# EAGLE board EEZ DIB DCP405 r3B3a (EAGLE 7.2.0), part 1 of 2
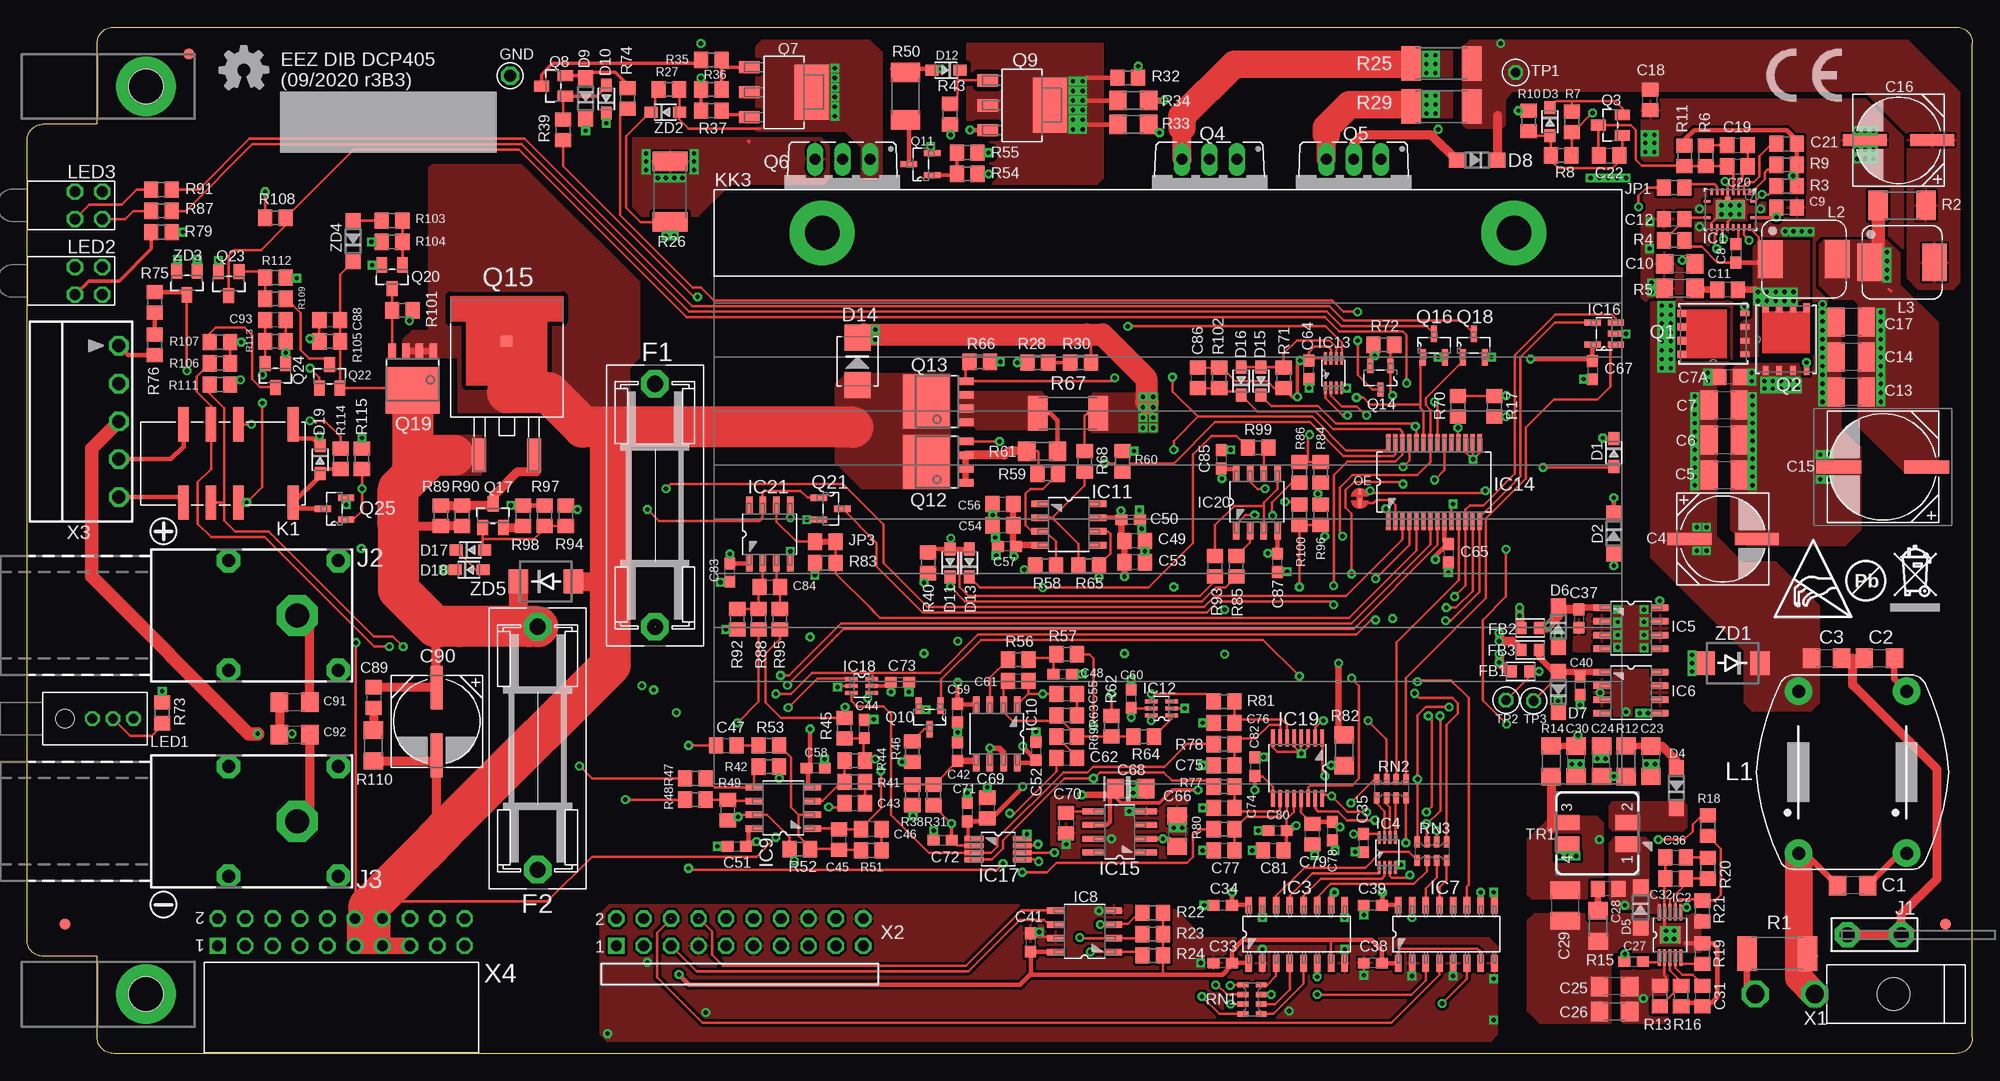
[diagram p6: board, top side]
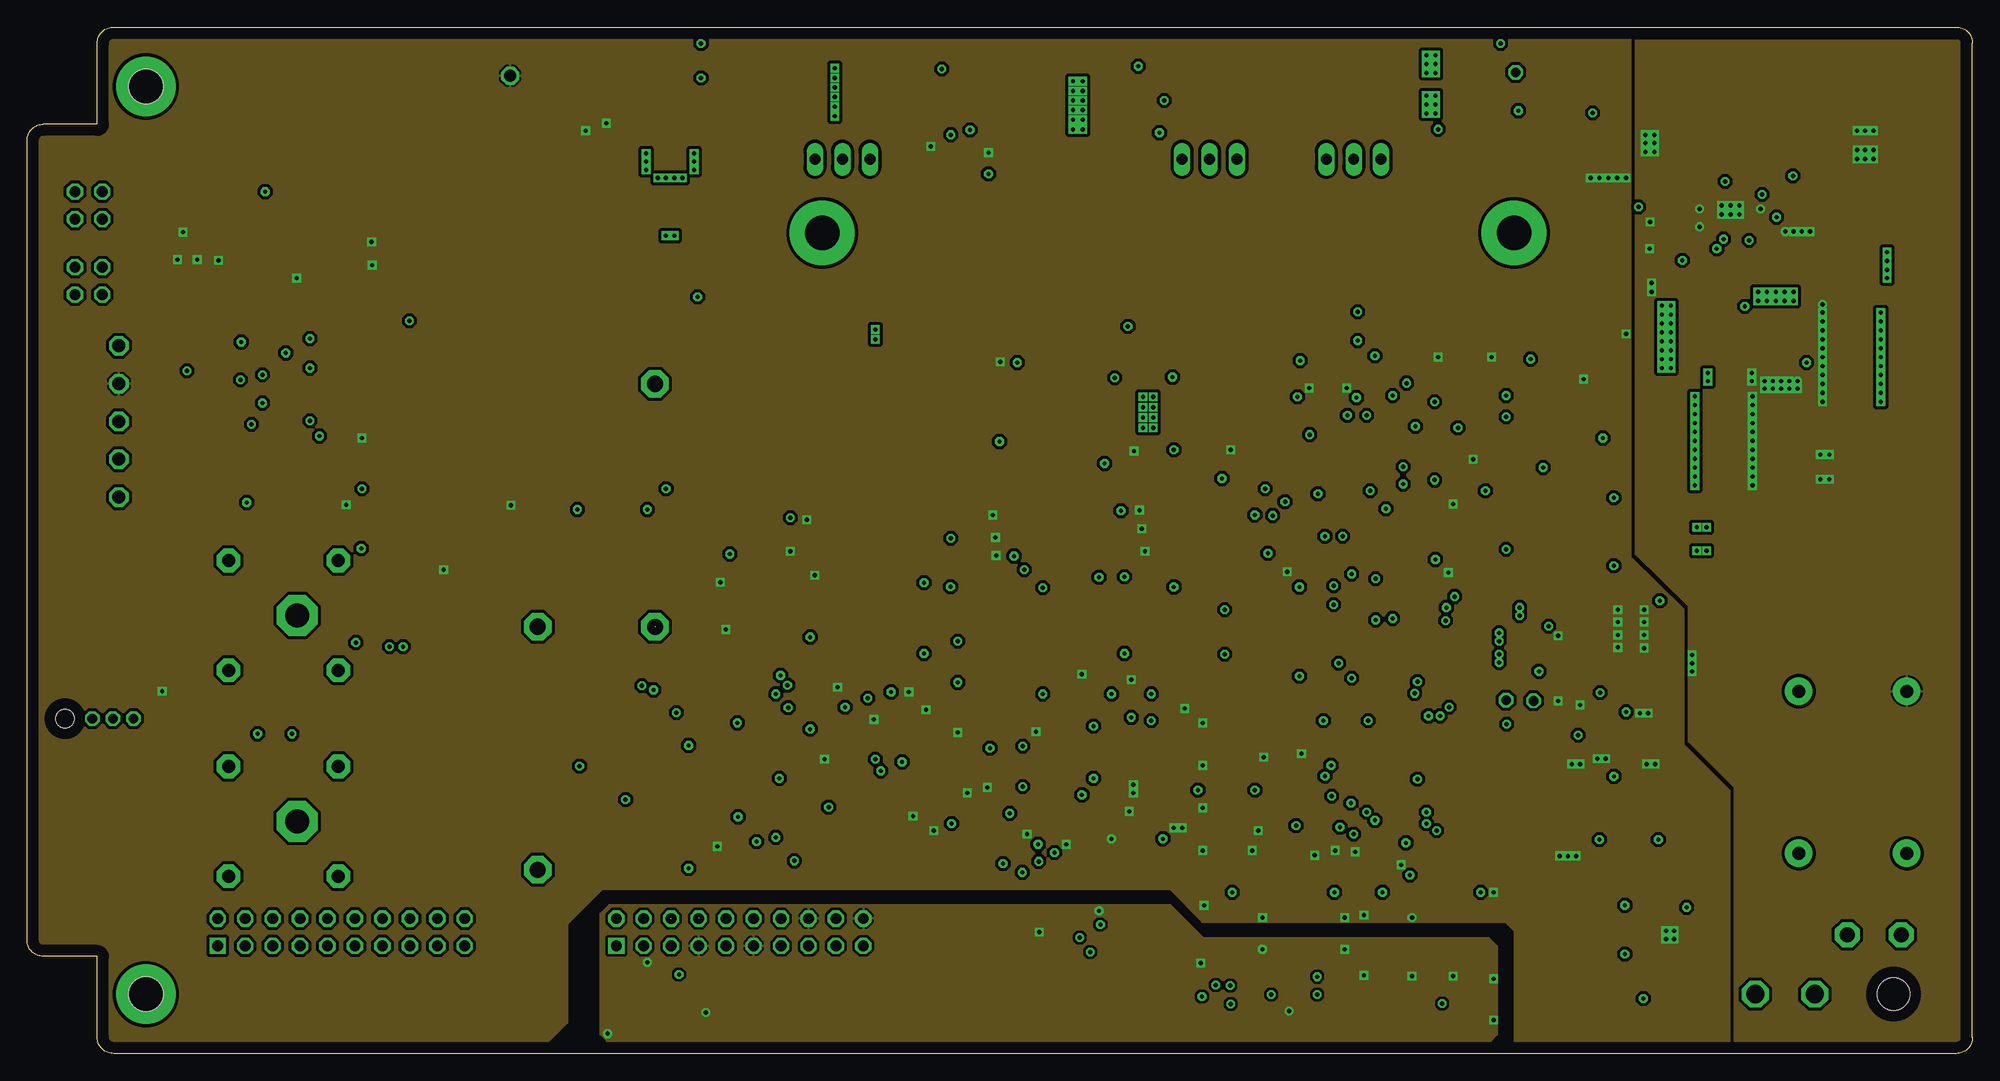
[diagram p7: board, inner layer L2]
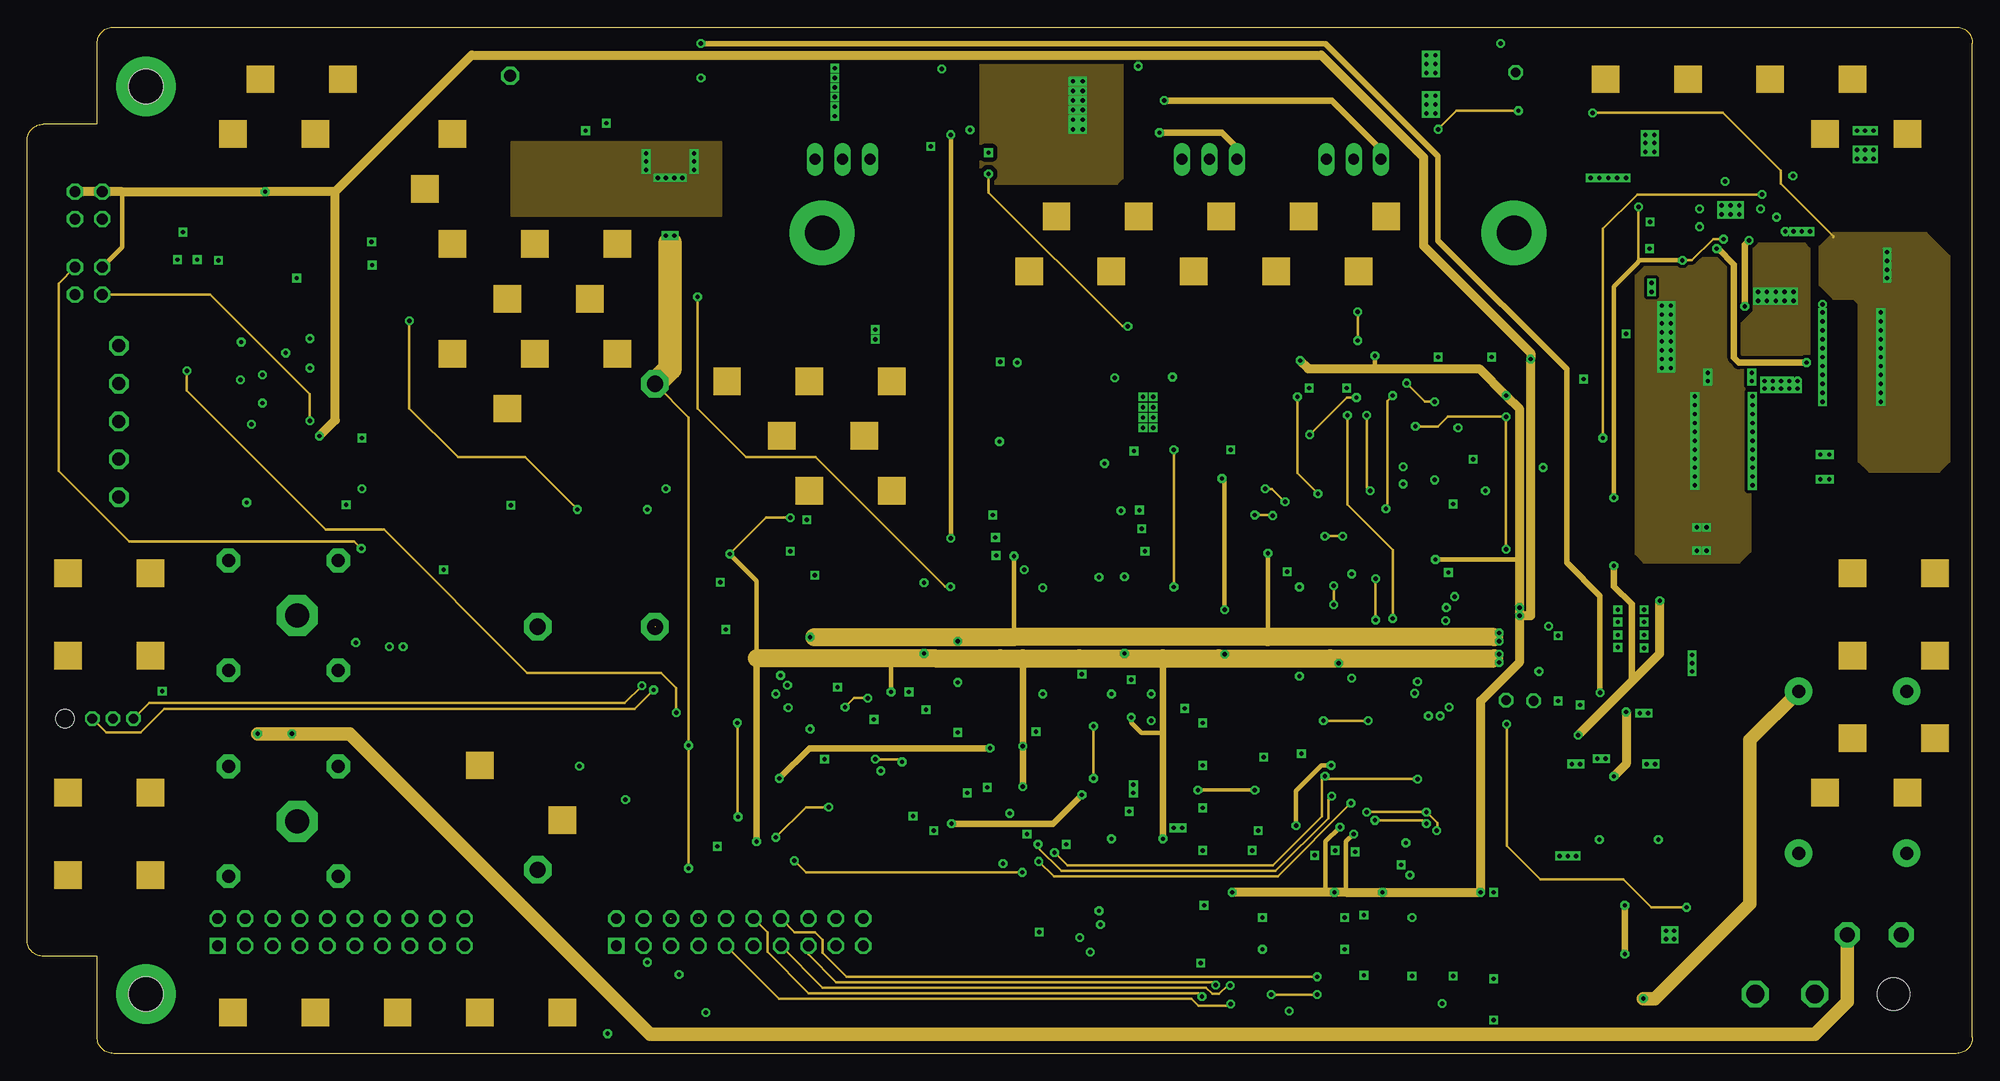
[diagram p8: board, inner layer L3]
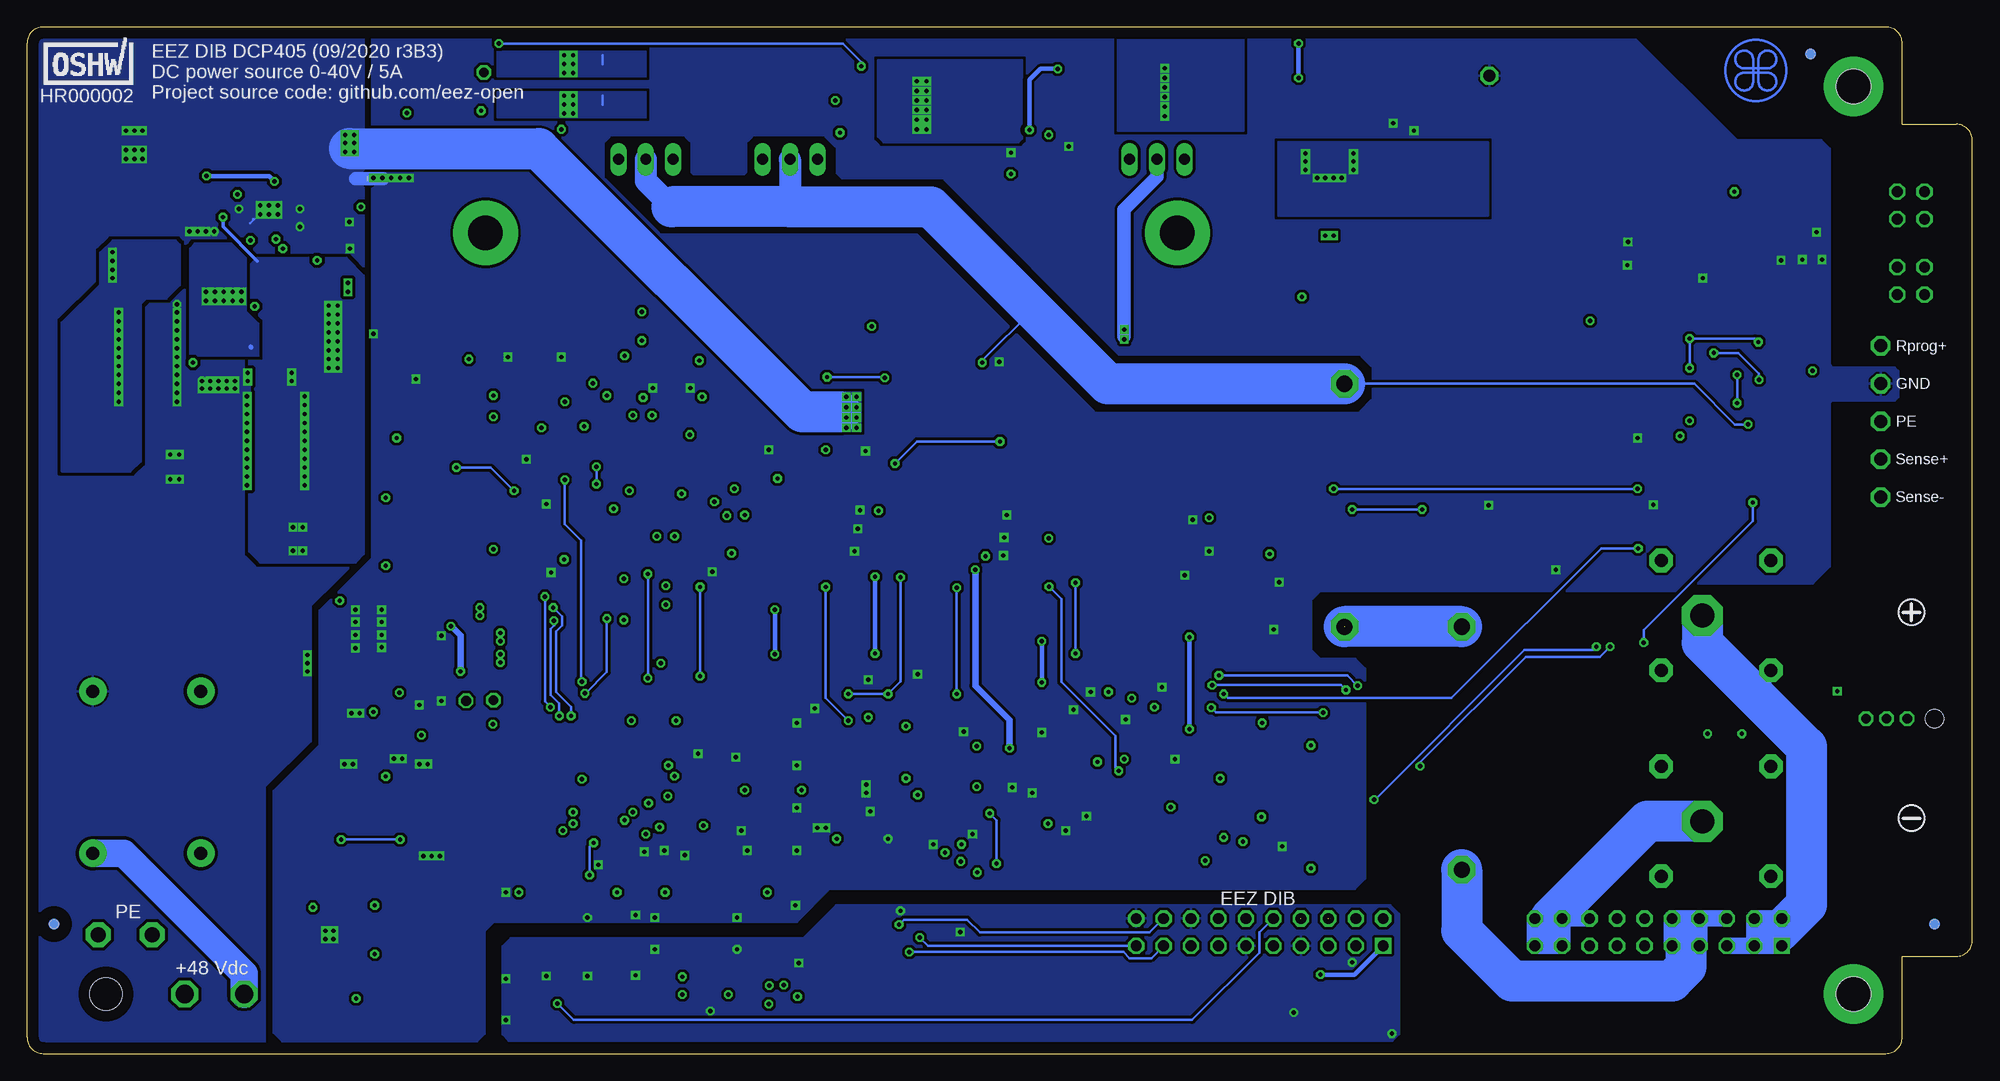
[diagram p9: board, bottom side, seen from below]

Size 180 x 95 mm. Coordinates in mm from the lower left corner, seen from the top.
Outline: 8,95 178.5,95 arc-90 180,93.5 180,1.5 arc-90 178.5,0 8,0 arc-90 6.5,1.5 6.5,9 1.5,9 arc-90 0,10.5 0,84.5 arc-90 1.5,86 6.5,86 6.5,93.5 arc-90 8,95
Copper layers (1+2+15+16): Top 0.035mm / dielectric 7mil / L2 0.03mm / dielectric 44mil / L3 0.03mm / dielectric 7mil / Bottom 0.035mm
Design rules "default *": minimum track width 6mil, minimum drill 0.3mm, track to track 6mil, track to pad 6mil, pad to pad 6mil, via to via 6mil, smd to smd 6mil, copper to edge 40mil, drill to drill 8mil, minimum pad ring 4mil, minimum via ring 8mil, stop-mask expansion 2.5mil, vias tented up to drill 1mm, thermal gap 8mil
Net classes: 0 default: width 0.203 mm, drill 0.3 mm, clearance 0.203 mm; 1 lvds: width 0.152 mm, drill 0.3 mm, clearance 0.152 mm to class 0, clearance 0.152 mm; 2 gnd: width 0.254 mm, drill 0.584 mm, clearance 0.254 mm
vRestrict: area 53,0 to 128,8.5; area 0,0 to 42,14

## Footprints (pad centres in the part's own frame; a part is rotated, then mirrored left to right if it is on the bottom)
C1206 = smd 1.6 x 1.8: 1 -1.4,0; 2 1.4,0
CAPAE830X1050N = smd 4.064 x 1.092: + -3.124,0; - 3.124,0
C1210 = smd 1.6 x 2.7: 1 -1.4,0; 2 1.4,0
C0805 = smd 1.3 x 1.5: 1 -0.95,0; 2 0.95,0
C0603 = smd 1.1 x 1: 1 -0.85,0; 2 0.85,0
CAPAE1030X1050N = smd 4.166 x 1.194: + -4.064,0; - 4.064,0
EC1206 = smd 1.6 x 1.8: + -1.4,0; - 1.4,0
SOD323-R = smd 1.2 x 1: A 1.3,0; C -1.3,0
SOD123 = smd 1.4 x 1.4: A 1.9,0; C -1.9,0
SMB = smd 2.4 x 2.4: A 2.2,0; C -2.2,0
ZH32 = drill 1.5 pad 2.54 octagon: 1 -11.25,0; 2 11.25,0
BEAD0603 = smd 1 x 1.1: P$1 -0.85,0; P$2 0.85,0
FIDUCIAL_DUAL = smd 1.016 x 1.016 bottom: B 0,0 | smd 1.016 x 1.016: T 0,0
PCB_SHIELD_TAB = drill 1.1 octagon: 1 0,0
RGY0020B = smd 0.24 x 0.6: 1 -0.75,2.15; 10 -0.75,-2.15; 11 0.75,-2.15; 20 0.75,2.15 | smd 0.6 x 0.24: 2 -1.65,1.75; 3 -1.65,1.25; 4 -1.65,0.75; 5 -1.65,0.25; 6 -1.65,-0.25; 7 -1.65,-0.75; 8 -1.65,-1.25; 9 -1.65,-1.75; 12 1.65,-1.75; 13 1.65,-1.25; 14 1.65,-0.75; 15 1.65,-0.25; 16 1.65,0.25; 17 1.65,0.75; 18 1.65,1.25; 19 1.65,1.75 | smd 1.7 x 2.7: 21 0,0
SOP50P490X110-11N = smd 1.549 x 0.279: 1 -2.108,0.991; 2 -2.108,0.508; 3 -2.108,0; 4 -2.108,-0.508; 5 -2.108,-0.991; 6 2.108,-0.991; 7 2.108,-0.508; 8 2.108,0; 9 2.108,0.508; 10 2.108,0.991 | smd 1.575 x 1.88: TP 0,0
SOIC-16 = smd 1.549 x 0.61: 1 -2.692,4.445; 2 -2.692,3.175; 3 -2.692,1.905; 4 -2.692,0.635; 5 -2.692,-0.635; 6 -2.692,-1.905; 7 -2.692,-3.175; 8 -2.692,-4.445; 9 2.692,-4.445; 10 2.692,-3.175; 11 2.692,-1.905; 12 2.692,-0.635; 13 2.692,0.635; 14 2.692,1.905; 15 2.692,3.175; 16 2.692,4.445
DCU8 = smd 1.168 x 0.254: 1 -1.372,0.75; 2 -1.372,0.25; 3 -1.372,-0.25; 4 -1.372,-0.75; 5 1.372,-0.75; 6 1.372,-0.25; 7 1.372,0.25; 8 1.372,0.75
SOIC127P600X173-8N = smd 1.55 x 0.6: 1 -2.7,1.9; 2 -2.7,0.63; 3 -2.7,-0.64; 4 -2.7,-1.91; 5 2.7,-1.91; 6 2.7,-0.64; 7 2.7,0.63; 8 2.7,1.9
SOT65P210X110-6N = smd 1.168 x 0.356: 1 -0.94,0.66; 2 -0.94,0; 3 -0.94,-0.66; 4 0.94,-0.66; 5 0.94,0; 6 0.94,0.66
SOP65P780X200-28N = smd 1.651 x 0.432: 1 -3.632,4.216; 2 -3.632,3.581; 3 -3.632,2.921; 4 -3.632,2.286; 5 -3.632,1.626; 6 -3.632,0.965; 7 -3.632,0.33; 8 -3.632,-0.33; 9 -3.632,-0.965; 10 -3.632,-1.626; 11 -3.632,-2.286; 12 -3.632,-2.921; 13 -3.632,-3.581; 14 -3.632,-4.216; 15 3.632,-4.216; 16 3.632,-3.581; 17 3.632,-2.921; 18 3.632,-2.286; 19 3.632,-1.626; 20 3.632,-0.965; 21 3.632,-0.33; 22 3.632,0.33; 23 3.632,0.965; 24 3.632,1.626; 25 3.632,2.286; 26 3.632,2.921; 27 3.632,3.581; 28 3.632,4.216
SOIC127P600X175-8N = smd 1.981 x 0.559: 1 -2.464,1.905; 2 -2.464,0.635; 3 -2.464,-0.635; 4 -2.464,-1.905; 5 2.464,-1.905; 6 2.464,-0.635; 7 2.464,0.635; 8 2.464,1.905
SOT23-5 = smd 1.524 x 0.559: 1 -1.079,1.016; 2 -1.079,0; 3 -1.079,-1.016; 4 1.079,-1.016; 5 1.079,1.016
DGK8-M = smd 1.727 x 0.483: 1 -2.235,0.965; 2 -2.235,0.33; 3 -2.235,-0.33; 4 -2.235,-0.965; 5 2.235,-0.965; 6 2.235,-0.33; 7 2.235,0.33; 8 2.235,0.965
PW(R-PDSO-G16) = smd 1.6 x 0.35: 1 -2.8,2.3; 2 -2.8,1.65; 3 -2.8,1; 4 -2.8,0.35; 5 -2.8,-0.3; 6 -2.8,-0.95; 7 -2.8,-1.6; 8 -2.8,-2.25; 9 2.8,-2.25; 10 2.8,-1.6; 11 2.8,-0.95; 12 2.8,-0.3; 13 2.8,0.35; 14 2.8,1; 15 2.8,1.65; 16 2.8,2.3
PCB_TAB-4907 = drill 1.4 pad 2.3 octagon: 1 -2.5,0; 2 2.5,0
S16N-PC = drill 2.2 pad 3.81 octagon: 1 0,0 | drill 1.2 pad 2.184 octagon: NC1 -3.8,5.08; NC2 -3.8,-5.08; NC3 6.36,5.08; NC4 6.36,-5.08
R_0805 = smd 1.3 x 1.5: 1 -0.95,0; 2 0.95,0
JP2-0805-NOCUT = smd 1.3 x 1.5: 1 -0.95,0; 2 0.95,0
FTR-C1 = smd 1 x 3.16: 1 -6.35,-3.62; 3 -1.27,-3.62; 4 1.27,-3.62; 5 3.81,-3.62; 8 3.81,3.62; 9 1.27,3.62; 10 -1.27,3.62; 12 -6.35,3.62
PCB-MB = hole 3.2: 0,0
SK96/84 = drill 3.2 pad 6: 1 10,4; 2 74,4
RN112 = drill 1.2 pad 2.54: 1 -7.5,5; 2 7.5,5; 3 -7.5,-5; 4 7.5,-5
PANASONIC_ETQ-P4_KFM = smd 2.3 x 3.5: 1 -3.1,0; 2 3.1,0
COILCRAFT_HPI0630 = smd 2.3 x 3.5: 1 -3,0; 2 3,0
L-42WUM-1EGWT = drill 0.9 octagon: CC 4.445,0; GREEN 6.35,0; RED 2.54,0 | hole 1.7: 0,0
WP934MD = drill 1 octagon: BA -1.27,1.27; BC -1.27,-1.27; TA 1.27,1.27; TC 1.27,-1.27
JP2-NOCUT = smd 0.889 x 0.254: 1 -0.445,0 | smd 0.508 x 0.254: 2 0.635,0
TDSON-8 = smd 0.838 x 0.508: 1 -2.913,1.905; 2 -2.913,0.635; 3 -2.913,-0.635; 4 -2.913,-1.905 | smd 0.813 x 0.61: 5 2.913,-1.905; 6 2.913,-0.635; 7 2.913,0.635; 8 2.913,1.905
SOT23-BEC = smd 1 x 1.4: B -0.95,-1.1; C 0,1.1; E 0.95,-1.1
TO220FP-V = drill 1.016 long: 1 -2.54,-0.203; 2 0,-0.203; 3 2.54,-0.203
SOT230P700X180-4N = smd 1.905 x 1.143: 1 -3.2,2.311; 2 -3.2,0; 3 -3.2,-2.311 | smd 3.175 x 5.08: 4 2.565,0
SOT103P240X110-3N = smd 1.524 x 0.559: 1 -1.079,1.016; 2 -1.079,-1.016; 3 1.079,0
SOT669 = smd 0.7 x 1.4: 1 -1.905,-2.65; 2 -0.635,-2.65; 3 0.635,-2.65; 4 1.905,-2.65 | smd 5 x 4.3: MB 0,1
SOT95P237X112-3N = smd 1.321 x 0.559: 1 -1.092,0.94; 2 -1.092,-0.94; 3 1.092,0
D2PAK = smd 1.3 x 3.1: 1 -2.54,-10.528; 3 2.54,-10.528 | smd 1 x 1: 2 0,0
R2512 = smd 1.8 x 3.2: 1 -2.8,0; 2 2.8,0
R2010 = smd 1.8 x 2.7: 1 -2.2,0; 2 2.2,0
R0805 = smd 1.3 x 1.5: 1 -0.95,0; 2 0.95,0
R1206 = smd 1.6 x 1.803: 1 -1.422,0; 2 1.422,0
R_2512-4WIRE = smd 1.8 x 3.2: 1 -2.8,0; 2 2.8,0 | smd 1.27 x 0.254: 1S -2.413,0; 2S 2.413,0
CAY16 = smd 0.5 x 1: 1 -1.35,-0.85; 2 -0.45,-0.85; 3 0.45,-0.85; 4 1.35,-0.85; 5 1.35,0.85; 6 0.45,0.85; 7 -0.45,0.85; 8 -1.35,0.85
SHORT_NOHOLE = smd 0.5 x 0.25 bottom: 1 0,0.117; 2 0,-0.117
TEST-PIN_0.9MM = drill 0.9 octagon: 1 0,0
SRF0703 = smd 1.4 x 2.3: 1 1,2.8; 2 -1,2.8; 3 -1,-2.8; 4 1,-2.8
MINIFIT_39301020 = drill 1.7 octagon: 1 0,0; 2 0,5.5 | hole 3: 0,-7.3
77317-104-20LF = drill 1 pad 1.5 square: 1 -22.86,-2.54 | drill 1 pad 1.5 octagon: 2 -22.86,0; 3 -20.32,-2.54; 4 -20.32,0; 5 -17.78,-2.54; 6 -17.78,0; 7 -15.24,-2.54; 8 -15.24,0; 9 -12.7,-2.54; 10 -12.7,0; 11 -10.16,-2.54; 12 -10.16,0; 13 -7.62,-2.54; 14 -7.62,0; 15 -5.08,-2.54; 16 -5.08,0; 17 -2.54,-2.54; 18 -2.54,0; 19 0,-2.54; 20 0,0
MC1,5/5-G-3,5 = drill 1.2 octagon: 1 -7,0; 2 -3.5,0; 3 0,0; 4 3.5,0; 5 7,0
SSW-110-02-T-D-RA = drill 1 pad 1.5 square: 1 22.86,2.54 | drill 1 pad 1.5 octagon: 2 22.86,0; 3 20.32,2.54; 4 20.32,0; 5 17.78,2.54; 6 17.78,0; 7 15.24,2.54; 8 15.24,0; 9 12.7,2.54; 10 12.7,0; 11 10.16,2.54; 12 10.16,0; 13 7.62,2.54; 14 7.62,0; 15 5.08,2.54; 16 5.08,0; 17 2.54,2.54; 18 2.54,0; 19 0,2.54; 20 0,0
DO214AA = smd 1.8 x 2.2: A 2.55,0; C -2.55,0
SOT23 = smd 1 x 1.4: 1 -0.95,-1.1; 2 0.95,-1.1; 3 0,1.1

## Placement (x,y rotation side)
C1  10n/200V  [C1206]  168.91,15.56 180 top
C2  10n/200V  [C1206]  171.39,36.58 180 top
C3  10n/200V  [C1206]  166.5,36.58 180 top
C4  EEEFK1H470P  [CAPAE830X1050N]  156.91,47.62 0 top
C5  4u7/100V  [C1210]  157.04,53.53 0 top
C6  4u7/100V  [C1210]  157.04,56.77 0 top
C7  4u7/100V  [C1210]  157.04,60.01 0 top
C7A  470n  [C0805]  157.54,62.61 180 top
C8  100n  [C0603]  158.12,74.04 270 top
C9  470n  [C0805]  162.81,78.3 180 top
C10  2u2  [C1206]  152.91,73.09 0 top
C11  1n  [C0805]  157.35,70.68 180 top
C12  15p  [C0805]  152.4,77.22 180 top
C13  10u  [C1210]  168.78,61.21 180 top
C14  10u  [C1210]  168.78,64.45 180 top
C15  EEEFK1J101P  [CAPAE1030X1050N]  171.7,54.29 180 top
C16  EEEFK1H470P  [CAPAE830X1050N]  173.16,84.52 180 top
C17  10u  [C1210]  168.78,67.69 180 top
C18  1u  [C0805]  150.18,88.27 90 top
C19  10n  [C0805]  158.24,84.07 0 top
C20  150p  [C0805]  158.24,82.11 0 top
C21  10n  [C0805]  162.81,84.2 0 top
C22  470p  [C0805]  146.37,83.12 0 top
C23  4u7  [C1206]  150.24,27.05 270 top
C24  4u7  [C1206]  145.67,27.05 90 top
C25  2u2  [C1206]  146.88,6.22 180 top
C26  2u2  [C1206]  146.88,3.87 180 top
C27  100n  [C0603]  148.65,8.51 0 top
C28  330p  [C0805]  146.3,15.24 180 top
C29  22u  [C1210]  142.3,13.72 270 top
C30  4u7  [C1206]  143.32,27.05 270 top
C31  10n  [C0805]  155,5.33 270 top
C32  33p  [C0805]  152.53,16.19 0 top
C33  100n  [C0603]  110.62,8.38 180 top
C34  100n  [C0603]  110.62,13.72 0 top
C35  100n  [C0603]  123.63,19.49 270 top
C36  10n  [C0805]  152.53,18.16 0 top
C37  100n  [C0603]  143.57,40.26 270 top
C38  100n  [C0603]  124.52,8.38 180 top
C39  100n  [C0603]  124.52,13.72 0 top
C40  100n  [C0603]  143.7,34.04 90 top
C41  100n  [C0603]  92.84,10.29 270 top
C42  100n  [C0603]  86.11,27.94 90 top
C43  100p  [C0805]  76.58,23.18 0 top
C44  100n  [C0603]  77.47,30.04 90 top
C45  33p  [C0805]  75.12,19.81 90 top
C46  N.C.  [C0805]  78.11,20.76 180 top
C47  100p  [C0805]  64.71,28.51 0 top
C48  100n  [C0603]  95.82,35.12 0 top
C49  10n  [C0805]  102.49,47.43 180 top
C50  100n  [C0603]  102.11,49.4 0 top
C51  100n  [C0603]  65.66,19.18 0 top
C52  100n  [C0603]  93.34,28 270 top
C53  1u  [C0805]  102.49,45.47 180 top
C54  10n  [C0805]  90.3,48.89 0 top
C55  4n7  [C0805]  96.2,33.27 180 top
C56  1u  [C0805]  90.3,50.85 0 top
C57  100n  [C0603]  90.68,46.93 180 top
C58  100n  [C0603]  72.96,26.42 180 top
C59  100n  [C0603]  86.11,31.5 90 top
C60  100n  [C0603]  102.17,32.83 90 top
C61  33p  [C0805]  91.69,34.48 0 top
C62  6n8  [C0805]  96.2,27.37 0 top
C64  100n  [C0603]  118.59,63.28 90 top
C65  100n  [C0603]  131.51,46.29 270 top
C66  4u7  [C1206]  106.43,20.57 90 top
C67  100n  [C0603]  144.84,63.25 270 top
C68  4u7 tant.  [EC1206]  102.11,24.51 0 top
C69  1u  [C0805]  88.84,22.73 90 top
C70  1u  [C0805]  96.14,21.34 270 top
C71  100n  [C0603]  87,22.35 270 top
C72  100n  [C0603]  84.71,19.75 0 top
C73  100n  [C0603]  80.77,34.35 0 top
C74  4n7  [C0805]  110.74,22.73 0 top
C75  4n7  [C0805]  110.74,26.67 0 top
C76  4n7  [C0805]  110.74,30.61 180 top
C77  4n7  [C0805]  110.74,18.8 0 top
C78  100n  [C0603]  120.78,20.57 90 top
C79  1u  [C0805]  118.94,20.32 90 top
C80  100n  [C0603]  115.7,20.64 0 top
C81  1u  [C0805]  115.32,18.8 0 top
C82  100n  [C0603]  113.6,26.54 270 top
C83  100n  [C0603]  65.02,44.51 90 top
C84  4n7  [C0805]  68.71,43.18 0 top
C85  100n  [C0603]  110.49,54.99 270 top
C86  4n7  [C0805]  108.33,62.55 270 top
C87  100n  [C0603]  115.7,45.4 90 top
C88  10n  [C0805]  28,67.88 180 top
C89  470n  [C0805]  32.07,32.96 270 top
C90  HHXC630A330MHA0  [CAPAE830X1050N]  37.91,30.73 270 top
C91  10n/200V  [C1206]  24.77,32.51 180 top
C92  10n/200V  [C1206]  24.77,29.53 0 top
C93  10n  [C0805]  22.99,67.88 180 top
D1  BAS316  [SOD323-R]  146.81,55.63 270 top
D2  SKL16  [SOD123]  146.81,48.13 270 top
D3  BAS316  [SOD323-R]  140.91,86.23 270 top
D4  SKL16  [SOD123]  152.59,24.57 90 top
D5  SKL16  [SOD123]  149.29,13.53 270 top
D6  SKL14  [SOD123]  141.67,39.5 270 top
D7  SKL14  [SOD123]  141.67,33.46 90 top
D8  N.C.  [SOD123]  134.18,82.68 180 top
D9  SKL14  [SOD123]  51.69,88.39 90 top
D10  BAS316  [SOD323-R]  53.59,88.33 90 top
D11  BAS316  [SOD323-R]  85.41,45.4 90 top
D12  BAS316  [SOD323-R]  85.03,91 180 top
D13  BAS316  [SOD323-R]  87.19,45.4 90 top
D14  SK55  [SMB]  76.83,64.07 270 top
D15  BAS316  [SOD323-R]  114.17,62.23 90 top
D16  N.C.  [SOD323-R]  112.33,62.23 90 top
D17  BAS316  [SOD323-R]  41.02,46.61 0 top
D18  BAS316  [SOD323-R]  40.89,44.77 0 top
D19  BAS316  [SOD323-R]  27.11,54.96 270 top
EEZ_SIGNATURE  SIGNATURESMALL  [SIGNATURE_5MM]  20.05,90.97 180 top
F1  ZH32  [ZH32]  58.1,50.74 270 top
F2  ZH32  [ZH32]  47.24,28.26 270 top
FB1  60R@100MHz  [BEAD0603]  138.18,35.37 180 top
FB2  60R@100MHz  [BEAD0603]  139.06,39.37 180 top
FB3  60R@100MHz  [BEAD0603]  139.06,37.34 180 top
FM1  FIDUCIAL_2  [FIDUCIAL_DUAL]  15,92.5 0 top
FM2  FIDUCIAL_2  [FIDUCIAL_DUAL]  177.5,12 0 top
FM3  FIDUCIAL_2  [FIDUCIAL_DUAL]  3.5,12 0 top
GND  [PCB_SHIELD_TAB]  44.7,90.49 0 top
IC1  LM5145RGYT  [RGY0020B]  157.61,78.11 270 top
IC2  TPS54060DGQ  [SOP50P490X110-11N]  152.02,10.99 90 top
IC3  SI8641BB-B-IS1  [SOIC-16]  117.47,11.05 90 top
IC4  SN74LVC1G139DCUR  [DCU8]  125.86,18.61 90 top
IC5  MC78L05  [SOIC127P600X173-8N]  148.4,39.37 0 top
IC6  MC79L05  [SOIC127P600X173-8N]  148.4,33.4 0 top
IC7  SI8641BB-B-IS1  [SOIC-16]  131.32,11.05 90 top
IC8  M24C32-WMN6P  [SOIC127P600X173-8N]  97.85,11.3 180 top
IC9  TL072D  [SOIC127P600X173-8N]  69.98,22.73 180 top
IC10  TL072D  [SOIC127P600X173-8N]  89.73,29.59 270 top
IC11  LTC2050HVCS8#PBF  [SOIC127P600X173-8N]  96.39,48.96 0 top
IC12  SN74LVC1G3157DCKR  [SOT65P210X110-6N]  104.97,31.94 180 top
IC13  74AUP1G74DC.125  [DCU8]  120.89,62.98 90 top
IC14  MCP23S17-E/SS  [SOP65P780X200-28N]  130.18,52.9 90 top
IC15  REF5025AIDR  [SOIC127P600X175-8N]  101.09,20.51 180 top
IC16  TC77-5.0MCTTR  [SOT23-5]  145.92,66.61 180 top
IC17  DAC8552IDGKR  [DGK8-M]  89.85,18.92 0 top
IC18  SN74LVC1G3157DCKR  [SOT65P210X110-6N]  77.22,34.04 0 top
IC19  ADS1120IPWR  [PW(R-PDSO-G16)]  117.54,26.42 270 top
IC20  LM293D  [SOIC127P600X173-8N]  113.79,51.05 90 top
IC21  MAX9141ESA  [SOIC127P600X173-8N]  68.71,48.07 90 top
J1  4907  [PCB_TAB-4907]  170.92,11 180 top
J2  FCR7350R  [S16N-PC]  25,40.55 180 top
J3  FCR7350B  [S16N-PC]  25,21.5 180 top
JP1  JP2-CUT-0805  [R_0805]  152.4,80.14 0 top
JP3  JP2-NOCUT-0805  [JP2-0805-NOCUT]  73.85,47.37 180 top
K1  FTR-C1GA005G-B05  [FTR-C1]  18.29,54.61 180 top
KK1  PMB-1  [PCB-MB]  11,89.5 0 top
KK2  PMB-1  [PCB-MB]  11,5.5 0 top
KK3  SK96/84  [SK96/84]  147.57,79.95 180 top
L1  RN112-4-02-0M7  [RN112]  168.91,26.04 90 top
L2  ETQ-P4M100KFM  [PANASONIC_ETQ-P4_KFM]  164.4,73.53 0 top
L3  HPI0630-3R3  [COILCRAFT_HPI0630]  173.48,73.22 0 top
LED1  WP42WUM/EGW  [L-42WUM-1EGWT]  3.5,31 0 top
LED2  WP934MD/2LID  [WP934MD]  5.7,71.5 0 top
LED3  WP934MD/LYLID  [WP934MD]  5.7,78.5 0 top
OE  JP2-NOCUT  [JP2-NOCUT]  123.32,51.37 90 top
OSHWA  HR000002  [CERT-SMALL-SILK]  174.31,89.66 0 bottom
Q1  BSC117N08NS5ATMA1  [TDSON-8]  156.02,66.61 180 top
Q2  BSC039N06NSATMA1  [TDSON-8]  162.75,66.1 90 top
Q3  MMBT5401  [SOT23-BEC]  146.49,85.92 90 top
Q4  D45H11FP  [TO220FP-V]  109.41,82.55 180 top
Q5  D45H11FP  [TO220FP-V]  122.75,82.55 180 top
Q6  FQPF11P06 or FQPF27P06  [TO220FP-V]  75.44,82.55 180 top
Q7  BCP56-16.115  [SOT230P700X180-4N]  70.04,88.96 0 top
Q8  MMBT5401  [SOT23-BEC]  48.7,89.53 90 top
Q9  NZT605  [SOT230P700X180-4N]  92.08,87.76 0 top
Q10  2N7002  [SOT103P240X110-3N]  83.5,31.11 270 top
Q11  BSS205NH6327XTSA1  [SOT103P240X110-3N]  82.68,82.3 180 top
Q12  PSMN0R9-25YLC  [SOT669]  84.2,54.74 90 top
Q13  PSMN0R9-25YLC  [SOT669]  84.2,60.33 90 top
Q14  BSS84P  [SOT95P237X112-3N]  125.22,62.55 270 top
Q15  BT139B-600E  [D2PAK]  44.39,65.91 0 top
Q16  2N7002  [SOT103P240X110-3N]  130.18,65.53 90 top
Q17  FMMT493TA  [SOT23-BEC]  43.12,49.78 0 top
Q18  2N7002  [SOT103P240X110-3N]  133.86,65.53 90 top
Q19  PSMN013-60YL  [SOT669]  35.69,62.36 180 top
Q20  MMBT5551  [SOT23-BEC]  33.78,71.88 180 top
Q21  2N7002  [SOT103P240X110-3N]  74.36,50.42 0 top
Q22  MMBT5401  [SOT23-BEC]  28,62.67 0 top
Q23  MMBT5551  [SOT23-BEC]  18.67,71.25 180 top
Q24  MMBT5551  [SOT23-BEC]  22.99,62.74 180 top
Q25  2N7002  [SOT103P240X110-3N]  28.45,50.42 180 top
R1  N.C.  [R2512]  161.93,9.27 0 top
R2  15R  [R2010]  173.48,78.49 180 top
R3  10K  [R0805]  162.81,80.26 180 top
R4  470R  [R0805]  152.4,75.25 0 top
R5  10R  [R1206]  152.91,70.8 0 top
R6  10K  [R0805]  155.32,83.06 270 top
R7  10K  [R0805]  142.94,86.23 90 top
R8  100K  [R0805]  141.92,83.12 180 top
R9  47K  [R0805]  162.81,82.23 180 top
R10  11K  [R0805]  138.94,86.3 90 top
R11  3K9  [R0805]  153.35,83.06 90 top
R12  10R  [R1206]  147.96,27.05 90 top
R13  47K  [R0805]  151.07,5.33 90 top
R14  10R  [R1206]  141.03,27.05 270 top
R15  10R  [R1206]  145.35,11.81 90 top
R16  2K2  [R0805]  153.03,5.33 90 top
R17  10K  [R0805]  135.76,59.88 270 top
R18  86K6  [R0805]  155.51,21.08 90 top
R19  330K  [R0805]  155,9.27 270 top
R20  86K6  [R0805]  155.51,17.14 270 top
R21  8K2  [R0805]  155,13.21 90 top
R22  10K  [R0805]  104.14,13.02 180 top
R23  10K  [R0805]  104.14,11.05 180 top
R24  10K  [R0805]  104.14,9.08 180 top
R25  0R1/2-3W  [R2512]  130.87,91.63 180 top
R26  2R2/2W  [R2512]  59.5,79.76 270 top
R27  4K7  [R0805]  59.37,89.22 0 top
R28  4K7  [R0805]  93.54,63.94 180 top
R29  0R1/2-3W  [R2512]  130.87,87.63 180 top
R30  4K7  [R0805]  97.47,63.94 180 top
R31  10K  [R0805]  83.88,23.94 90 top
R32  2K2  [R0805]  101.85,90.3 0 top
R33  10R  [R1206]  102.36,85.98 0 top
R34  10R  [R1206]  102.36,88.2 0 top
R35  4K7  [R0805]  63.31,91.95 180 top
R36  1K  [R0805]  63.31,89.22 180 top
R37  220R  [R0805]  63.31,87.25 180 top
R38  220R  [R0805]  81.92,23.94 270 top
R39  22K  [R0805]  49.59,85.47 90 top
R40  2K2  [R0805]  83.38,45.4 270 top
R41  10K  [R0805]  76.58,25.15 180 top
R42  7K5 0.1%  [R0805]  68.64,26.54 180 top
R43  1K  [R0805]  85.41,86.93 90 top
R44  10K  [R0805]  76.58,27.11 180 top
R45  2K2  [R0805]  75.63,30.1 270 top
R46  22K  [R0805]  81.92,27.94 270 top
R47  124K 0.1%  [R0805]  61.85,25.46 180 top
R48  124K 0.1%  [R0805]  61.85,23.5 180 top
R49  7K5 0.1%  [R0805]  64.83,22.54 90 top
R50  15R  [R2010]  81.28,88.58 90 top
R51  N.C.  [R0805]  78.11,18.8 0 top
R52  10K  [R0805]  71.5,18.92 0 top
R53  10K  [R0805]  68.64,28.51 0 top
R54  220R  [R0805]  87,81.41 0 top
R55  100K  [R0805]  87,83.38 180 top
R56  2K2  [R0805]  91.69,36.45 180 top
R57  2K2  [R0805]  96.2,36.96 180 top
R58  39K 0.1%  [R0805]  94.23,45.15 0 top
R59  820R 0.1%  [R0805]  94.42,53.66 0 top
R60  47K  [R0805]  101.35,54.8 270 top
R61  1R  [R1206]  93.92,55.75 0 top
R62  22K  [R0805]  100.33,30.29 270 top
R63  8K2  [R0805]  96.2,31.31 180 top
R64  470R  [R0805]  103.31,29.34 180 top
R65  39K 0.1%  [R0805]  98.23,45.15 0 top
R66  47K  [R0805]  88.14,64.01 180 top
R67  0R010 (low TCR)  [R_2512-4WIRE]  96.33,59.25 180 top
R68  820R 0.1%  [R0805]  97.85,54.8 270 top
R69  1K  [R0805]  96.2,29.34 0 top
R70  1K  [R0805]  132.4,59.88 270 top
R71  10K  [R0805]  116.27,62.55 90 top
R72  100K  [R0805]  125.54,65.6 0 top
R73  270R  [R0805]  12.51,31.53 90 top
R74  2K2  [R0805]  55.56,88.39 270 top
R75  470R  [R0805]  11.81,69.53 270 top
R76  470R  [R0805]  11.81,65.6 270 top
R77  2K2  [R0805]  110.74,24.7 0 top
R78  2K2  [R0805]  110.74,28.64 0 top
R79  470R  [R0805]  12.45,76.01 180 top
R80  2K2  [R0805]  110.74,20.76 0 top
R81  2K2  [R0805]  110.74,32.58 0 top
R82  10R  [R1206]  121.86,28.07 270 top
R83  10K  [R0805]  73.85,45.4 0 top
R84  4K7  [R0805]  119.7,53.78 270 top
R85  10K  [R0805]  111.89,45.09 90 top
R86  4K7  [R0805]  117.73,53.78 90 top
R87  330R  [R0805]  12.45,77.98 0 top
R88  330R  [R0805]  67.69,40.2 90 top
R89  1K  [R0805]  38.29,49.78 270 top
R90  1K  [R0805]  40.26,49.78 270 top
R91  330R  [R0805]  12.45,79.95 180 top
R92  10K  [R0805]  65.72,40.2 270 top
R93  10K  [R0805]  109.92,45.09 270 top
R94  1K  [R0805]  49.85,49.78 90 top
R95  10K  [R0805]  69.66,40.2 90 top
R96  4K7  [R0805]  119.7,49.85 90 top
R97  100K  [R0805]  47.88,49.78 270 top
R98  6R2  [R0805]  45.91,49.78 270 top
R99  10K  [R0805]  113.92,56.07 0 top
R100  4K7  [R0805]  117.73,49.85 270 top
R101  1K  [R0805]  34.73,68.77 0 top
R102  4K7  [R0805]  110.3,62.55 270 top
R103  22K  [R0805]  33.78,77.09 180 top
R104  22K  [R0805]  33.78,75.12 0 top
R105  330R  [R0805]  28,65.91 0 top
R106  750R  [R0805]  17.84,63.88 0 top
R107  3K3  [R0805]  17.84,65.85 0 top
R108  10K  [R0805]  22.99,77.34 180 top
R109  10K  [R0805]  22.99,69.85 0 top
R110  1R  [R1206]  32.07,28.51 90 top
R111  750R  [R0805]  17.84,61.91 180 top
R112  47K  [R0805]  22.99,71.82 180 top
R113  330R  [R0805]  22.99,65.91 0 top
R114  470R  [R0805]  29.02,55.05 90 top
R115  100K  [R0805]  30.99,55.05 270 top
RN1  DR1206-33R-4/8  [CAY16]  113.35,5.02 90 top
RN2  DR1206-33R-4/8  [CAY16]  126.24,24.51 0 top
RN3  DR1206-33R-4/8  [CAY16]  129.98,18.73 0 top
SH1  [SHORT_NOHOLE]  148.34,80.96 270 top
SH2  [SHORT_NOHOLE]  157.35,79.06 0 bottom
TP1  [TEST-PIN_0.9MM]  137.73,90.81 0 top
TP2  [TEST-PIN_0.9MM]  136.84,32.7 0 top
TP3  [TEST-PIN_0.9MM]  139.38,32.64 0 top
TR1  SRF0703-821M  [SRF0703]  145.29,20.38 270 top
U$1  [RECYCLE_BIN1/8]  172.41,40.9 0 top
U$2  [CE_5MM]  160.91,88 0 top
U$6  [ESD_SYMBOL]  161.7,40.41 0 top
U$7  [PB_SMALL]  170.12,43.75 0 top
X1  39-30-1020  [MINIFIT_39301020]  165.41,5.5 90 top
X2  77317-104-20LF  [77317-104-20LF]  77.38,12.5 0 top
X3  691322110005  [MC1,5/5-G-3,5]  8.5,58.5 270 top
X4  DS1024-2*10R0  [SSW-110-02-T-D-RA]  40.5,12.5 180 top
ZD1  SMAJ51A  [DO214AA]  157.8,36.13 180 top
ZD2  MM3Z9V1T1G  [SOD323-R]  59.05,87.12 0 top
ZD3  SLVU2.8-TP  [SOT23]  14.8,71.31 180 top
ZD4  MMSZ5230BT1G  [SOD123]  30.16,75.18 90 top
ZD5  SMAJ51A  [DO214AA]  48.01,43.69 0 top

## Tracks (layer width: path | path; a pad name or v marks a point on that pad's centre or on a via)
5A_S
  pour Top (isolate 0.254, no thermals): 86.17,61.21 93.85,61.21 94.3,60.77 94.3,57.78 87.88,57.78 87.57,58.1 86.17,58.1
50MA_S
  Top 0.254: R61.1 93.47,55.75 93.6,55.63 93.6,53.78 R59.1
  Top 0.61: Q12.3 Q12.2 Q12.1
  Top 0.813: R61.1 90.81,55.75 90.42,55.37 Q12.3
!ADC_DRDY  (via drill 0.4)
  Top 0.254: IC19.14 118.54,24.62 118.75,24.83 122.62,24.83 123.25,25.46 123.25,34.04 v122.56,34.73 | v127.32,52.7 127.13,52.9 122.75,52.9 121.98,52.13 121.98,50.55 122.56,49.97 v122.56,44.39 | IC14.25 127.89,54.86 v127.32,54.29
  Bottom 0.254: v127.32,54.29 v127.32,52.7 | v122.56,44.39 v122.56,34.73
!DP_DRIVE
  Top 0.254: R74.1 55.56,89.66 55.37,89.85
  Top 0.305: 51.95,90.55 D9.A | Q8.E 51.5,90.48 D9.A | D9.A 51.69,90.55 51.94,90.81 54.42,90.81 55.37,89.85
!IOEXP_RST  (via drill 0.4)
  Top 0.254: IC14.18 132.4,56.59 v132.4,57.91 R70.2
!OVP_FAULT  (via drill 0.4)
  Top 0.203: C86.2 R102.2
  Top 0.254: v120.9,43.31 120.9,53.53 122.17,54.8 126.62,54.8 127.25,55.44 IC14.26 127.25,57.53 127,57.78 120.84,57.78 119.19,59.44 113.83,59.44 D16.C 111.98,61.28 110.3,61.28 R102.2 | Q21.3 78.61,47.24 78.61,45.09 82.87,40.83 109.16,40.83 110.17,41.85 120.59,41.85 v120.9,41.53
  L3 0.254: v120.9,43.31 v120.9,41.53
!SET_DP  (via drill 0.4)
  Top 0.254: IC14.1 125.96,50.19 v125.73,50.42 | R72.2 126.16,65.52 Q14.1 126.16,61.1 v126.36,60.9
  L3 0.254: v125.73,50.42 125.86,50.55 125.86,60.39 v126.36,60.9
+3V3  (via drill 0.4)
  Top 0.254: IC7.7 134.49,9.4 134.18,9.72 127.13,9.72 126.87,9.46 IC7.1 | R22.1 R23.1 R24.1 105.09,7.3 | IC3.7 120.65,10.41 120.78,10.54
  Top 0.406: IC7.1 125.33,8.36 C38.1 125.37,9.56 124.4,10.54 120.78,10.54 112.52,10.54 111.47,9.49 C33.1 | 92.88,9.68 C41.2 92.87,9.4 | C33.1 111.51,8.22 111.51,8.19 110.62,7.3 105.09,7.3 92.9,7.3 92.87,7.33 | IC3.1 113,8.38 C33.1 | 92.87,9.4 92.87,7.33 | IC8.8 92.87,9.4 | 92.87,7.33 91.89,6.35 61.28,6.35 v60.33,7.3
  Bottom 0.406: v60.33,7.3 57.18,7.3 X2.1
+5V  (via drill 0.4)
  Top 0.203: C86.1 R102.1
  Top 0.254: IC19.13 117.89,22.32 C79.2 | Q14.2 124.28,65.54 R72.1 124.59,64.7 | R84.2 119.44,52.58 v119.44,51.82 119.44,50.54 R96.2 | 123.74,20.32 125.11,20.32 IC4.8 | R17.1 135.83,60.89 136.27,60.89 v136.84,60.9 | IC13.8 118.81,64.35 C64.2 118.59,64.87 119.13,65.41 120.4,65.41 120.64,65.16 IC13.7 | 116.71,61.6 R71.1 115.38,61.6 114.75,62.23 111.82,62.23 110.56,63.5 R102.1 | R108.2 v22.04,79.76 | 135.7,60.89 R17.1 | R70.1 R17.1
  Top 0.305: IC16.5 145.22,65.6 | v117.79,64.14 117.54,63.88 v117.54,60.77 117.1,60.77 R71.1
  Top 0.406: IC7.16 125.4,13.74 | 125.4,13.74 C39.2 | IC3.16 111.49,13.74 | 111.49,13.74 C34.2 | C79.2 119.09,21.42 C78.2 121.01,21.42 v121.47,20.95 | 123.74,20.32 C35.1 122.77,20.34 v122.75,20.32 | C65.1 131.47,47.01 131.28,47.01 130.3,46.04 v130.3,45.72 | IC14.9 131.14,47.38 C65.1 | C65.1 131.41,47.14 | K1.1 24.7,58.17 24.7,56.96 24.64,56.9 26.48,56.9 D19.C | D19.C 27.11,56.45 | 124.59,64.7 v124.71,64.58 | v27.05,57.15 27.05,56.32 D19.C | 111.49,13.74 111.49,14.91 v111.51,14.92 | IC3.10 120.65,14.61 v120.97,14.92 | 125.4,13.74 v125.4,14.91 v125.41,14.92 | IC7.10 v134.49,14.92 | v139.13,64.26 144.8,64.26 C67.1 IC16.5 | C64.2 v117.79,64.13 v117.79,64.14
  Top 0.813: v138.11,41.27 v138.11,40.51 138.11,39.47 FB2.P$2
  L3 0.254: v117.54,60.77 117.54,53.72 v119.44,51.82
  L3 0.406: 120.14,14.92 120.14,19.62 v121.47,20.95 | LED2.TA 8.83,74.63 8.83,79.76 | v124.71,64.58 124.71,63.44 124.78,63.37 | v130.3,45.72 137.86,45.72 138.11,45.97 | v122.75,20.32 122.05,19.62 122.05,14.92
  L3 0.61: v138.11,40.51 138.11,40.58
  L3 0.813: 28.51,79.76 28.51,58.61 v27.05,57.15 | 28.51,79.76 v22.04,79.76 8.83,79.76 6.98,79.76 LED3.TA LED3.BA | v111.51,14.92 120.14,14.92 v120.97,14.92 122.05,14.92 v125.41,14.92 v134.49,14.92 134.49,32.64 138.11,36.26 v138.11,40.51 139.13,40.51 v139.13,64.26 139.13,64.83 129.22,74.74 129.22,82.93 119.76,92.39 41.15,92.39 28.51,79.76 | v117.79,64.14 118.56,63.37 124.78,63.37 134.37,63.37 v136.84,60.9 138.11,59.63 138.11,45.97 138.11,40.58
+5VOUT  (via drill 0.4)
  Top 0.254: FB1.P$1 139.03,34.89 TP2.1
  Top 0.61: IC5.1 143.73,41.27 C37.1 | FB1.P$1 v139.89,35.37
  Top 0.813: 139.89,39.4 FB2.P$1 140.59,39.37 v140.78,39.56 141.67,40.45 D6.C 141.77,41.11 C37.1
  Bottom 0.61: v139.89,35.37 139.89,38.67 v140.78,39.56
+VNR  (via drill 0.4)
  Top 0.61: C30.1 143.3,28.47 143.29,28.47 | R14.1 143.29,28.47 | v151.07,41.91 151.07,41.3 IC5.8 | 143.29,28.47 143.26,28.51 143.26,29.21 v143.51,29.46 | D2.A v146.81,45.15
  L3 0.61: 147.99,33.94 148.46,34.42 148.46,41.59 146.81,43.24 v146.81,45.15
  L3 0.813: v143.51,29.46 147.64,33.59 147.99,33.94 151.07,37.02 v151.07,41.91
+VREF  (via drill 0.4)
  Top 0.254: IC19.9 115.25,23.65 115.25,24.7 114.33,25.63 113.67,25.63 C82.2 113.51,26.1 | IC17.2 86.05,19.25 C72.2 | 100.46,23.94 100.2,24.19 100.14,24.26 | R31.1 84.07,22.73 v85.53,21.27
  Top 0.305: 100.46,23.94 100.39,24.45 100.39,24.19 100.39,24 | 100.39,24 100.46,23.94 | 100.46,23.94 101.22,23.18 104.78,23.18 105.98,24.38 v108.33,24.38 | v113.6,24.38 C82.2 | 100.39,24 100.33,24 100.14,23.81 | C72.2 85.56,21.25 v85.53,21.27
  Top 0.406: 100.39,24.19 C68.+ 100.2,24.45 100.2,24.19 100.2,21.46 99.89,21.14 IC15.6
  Top 0.61: v97.6,23.94 100.46,23.94
  L3 0.305: v108.33,24.38 v113.6,24.38
  L3 0.61: v85.53,21.27 94.93,21.27 v97.6,23.94
-9V  (via drill 0.4)
  Top 0.254: R36.2 v62.36,90.29 v62.36,90.3
  Top 0.305: 147.93,25.65 R12.1 | 61.92,86.81 R37.2 R36.2
  Top 0.406: IC6.3 145.54,32.76 v145.54,33.4
  Top 0.61: C24.1 v146.81,25.65 147.93,25.65
  L3 0.508: v145.54,33.4 145.54,42.35 142.46,45.43 142.46,63.34 130.56,75.25 130.56,83.06 120.14,93.47 v62.36,93.47
  L3 0.813: v147.96,31.62 147.96,26.8 v146.81,25.65
  Bottom 0.406: v62.36,93.47 v62.36,90.3
  pour Top (isolate 0.254): 145.03,31.31 145.03,35.5 151.76,35.5 151.76,31.31
AGND  (via drill 0.4)
  Top 0.254: v157.1,80.7 157.36,80.45 IC1.6 157.36,79.05 SH2.1
  Top 0.406: C21.2 R9.1 163.76,80.77 | R3.1 163.76,80.77 | C21.2 163.76,83.95 | v163.39,81.22 163.76,80.77 | 153.35,84.2 R11.2 153.35,84.58 154.24,85.47 162.81,85.47 163.76,84.52 C21.2
  Bottom 0.406: v163.39,81.22 157.62,81.22 v157.1,80.7
AUX_IN  (via drill 0.4)
  Top 0.254: IC18.1 76.26,34.71 73.13,34.71 v70.42,32 | v14.8,63.18 ZD3.3
  Top 0.406: R75.1 14.86,70.48 14.86,70.27 ZD3.3
  L3 0.254: v60.07,31.56 60.07,33.85 58.67,35.24 46.29,35.24 33.02,48.51 27.62,48.51 14.8,61.34 v14.8,63.18
  Bottom 0.254: v60.07,31.56 69.98,31.56 v70.42,32
AUX_USET_SW  (via drill 0.4)
  Top 0.254: v124.78,40.13 124.33,40.13 123,38.8 88.01,38.8 84.45,35.24 78.23,35.24 | 78.23,35.24 72.64,35.24 70.67,33.27 v69.28,33.27 | IC18.6 78.23,34.77 78.23,35.24 | IC14.4 127.89,47.05 v124.78,43.94
  L3 0.254: LED2.BA 2.92,71.26 2.92,53.91 9.46,47.37 30.29,47.37 v30.92,46.74 | v124.78,43.94 v124.78,40.13
  Bottom 0.254: v30.92,46.74 34.35,46.74 48.2,32.89 68.9,32.89 v69.28,33.27
CC_ACTIVE  (via drill 0.4)
  Top 0.254: R96.1 R100.2 v117.73,43.18 | 129.86,56.52 IC14.22 | IC14.22 129.84,54.72 128.65,53.53 122.62,53.53 121.47,52.39 121.47,48.13 v121.73,47.88 | IC14.22 129.86,56.54 129.86,59.56 129.41,60.01 129.41,60.64 132.84,64.07 Q18.1 | 119.83,48.77 R96.1 | v120.08,47.88 120.08,48.52 R96.1 | v117.73,34.92 114.36,38.29 88.27,38.29 84.58,34.61 84.58,32.51 Q10.1
  L3 0.254: v121.73,47.88 v120.08,47.88
  Bottom 0.254: v117.73,43.18 v117.73,34.92
CC_LED
  Top 0.254: R91.2 10.16,79.95 8.76,78.55 5.75,78.55 LED3.BC
CS_ADC  (via drill 0.4)
  Top 0.254: IC19.2 119.19,30.16 119.83,30.8 v119.95,30.8 | RN2.7 125.79,29.09 v124.08,30.8
  L3 0.254: v124.08,30.8 v119.95,30.8
CS_DAC  (via drill 0.4)
  Top 0.254: v122.49,23.18 124.67,25.36 RN2.8 | IC17.5 93.42,17.96 v93.6,17.78
  L3 0.254: v122.49,23.18 115.76,16.38 95,16.38 v93.6,17.78
CS_IOEXP
  Top 0.254: RN2.6 126.69,38.04 132.46,43.81 IC14.11
CSA
  Top 0.254: IC4.1 125.09,17.22 125.09,16.7 118.94,16.7 116.84,14.61 IC3.13
CSB
  Top 0.254: IC3.12 118.11,14.61 119.7,16.19 125.35,16.19 125.61,16.45 IC4.2
CURR_5A  (via drill 0.4)
  Top 0.254: IC14.28 125.98,56.5 125.98,55.94 125.86,55.82 122.05,55.82 118.94,58.93 108.33,58.93 | 108.33,58.93 105.98,61.28 v105.98,62.61 | v106.11,55.88 106.11,56.71 108.33,58.93 | v100.65,62.55 100.33,62.23 Q13.4 86.85,63.67 R66.2 | IC12.6 104.03,30.81 v104.01,30.8
  L3 0.254: v106.11,43.18 v106.11,55.88
  Bottom 0.254: v105.98,62.61 100.71,62.61 v100.65,62.55 | v106.11,43.18 106.11,32.89 v104.01,30.8
CURR_50MA  (via drill 0.4)
  Top 0.254: IC14.27 126.59,55.47 126.43,55.31 121.79,55.31 118.68,58.42 109.92,58.42 106.11,54.61 102.11,54.61 R60.2 100.59,54.61 v99.69,54.61 | Q12.4 v89.98,56.64
  Bottom 0.254: v89.98,56.64 97.66,56.64 v99.69,54.61
CV_ACTIVE  (via drill 0.4)
  Top 0.254: R86.2 118.36,54.73 | 118.36,54.73 R84.1 | IC14.23 129.21,59.45 128.91,59.75 128.91,60.13 | 128.91,60.13 128.84,60.07 124.27,60.07 123.64,60.71 v123,60.71 | v118.68,57.28 118.49,57.09 118.49,54.86 118.36,54.73 | 128.91,60.13 128.91,64.2 Q16.1
  L3 0.254: v123,60.71 122.11,60.71 v118.68,57.28
CV_LED
  Top 0.254: R87.1 9.84,77.98 9.1,77.23 LED3.TC
D_CC
  Top 0.254: R91.1 15.88,79.95 20.57,84.64 46.04,84.64 61.53,69.15 120.52,69.15 121.86,67.82 132.65,67.82 Q18.3
D_CV
  Top 0.254: R87.2 14.67,77.98 20.83,84.14 45.78,84.14 61.28,68.64 120.27,68.64 121.6,67.31 129.48,67.31 Q16.3
DARL_C1  (via drill 0.4)
  Top 0.254: 97.98,90.3 v97.66,89.98 | 98.11,85.98 v97.66,85.53
  Top 0.406: R32.1 97.98,90.3 | R34.1 v97.66,88.2 | R33.1 98.11,85.98
  other vias: 96.77,89.98 96.77,89.09 96.77,88.2 96.77,87.31 96.77,86.42 96.77,85.53 97.66,89.09 97.66,87.31 97.66,86.42
  pour Top (isolate 0.406, no thermals): 87,93.47 99.5,93.47 99.5,81.03 99,80.52 87.31,80.52 87,80.84
  pour Bottom (isolate 0.406, no thermals): 87.95,91.95 101.28,91.95 101.28,84.84 100.77,84.33 88.27,84.33 87.95,84.65
  pour L3 (isolate 0.406, no thermals): 88.2,93.47 101.35,93.47 101.35,81.03 100.84,80.52 88.52,80.52 88.2,80.84
DC+
  Top 0.305: R1.2 163.91,9.27
  Top 0.61: L1.1 164.53,18.54 C1.2 | R1.2 165.16,9.27 165.41,9.02
  Top 2.54: L1.1 163.91,9.27 163.91,7 X1.1
DC-
  Top 0.61: L1.3 173.29,18.54 C1.1 | R1.1 159.12,6.29 X1.2
  Bottom 2.54: X1.2 159.91,7.38 171.06,18.54 L1.3
DC_OUT  (via drill 0.4)
  Top 0.254: IC2.2 151.51,7.18 151.64,7.05 | C9.2 v161.86,77.41 161.81,77.36 161.47,77.36
  Top 0.305: IC1.20 161.47,77.36
  L3 1.27: L1.2 159.38,29.01 159.38,13.84 150.62,5.08 v149.54,5.08
  Bottom 0.305: v161.86,77.41 161.86,76.52 158.69,73.34
  other vias: 152.08,68.39 152.08,67.56 152.08,66.74 152.08,65.91 152.08,65.09 152.08,64.26 151.26,67.56 151.26,66.74 151.26,65.91 151.26,65.09 151.26,64.26 155.51,62.99 155.51,62.23 154.31,60.83 154.31,60.01 154.31,59.18 154.31,58.36 154.31,57.53 154.31,56.71 154.31,55.88 154.31,55.05 154.31,54.23 155.38,48.7 154.5,48.7 155.38,46.55 154.5,46.55 151.26,68.39 152.08,63.44 151.26,63.44 152.08,69.22 151.26,69.22 154.31,53.4 154.31,52.58
  pour Top (isolate 0.305, no thermals): 151.07,9.46 151.83,9.46 151.83,3.17 151.51,2.86 147.76,2.86 147.51,3.11 147.51,7.68 151.07,7.68
  pour Top (isolate 0.305, no thermals): 156.27,47.88 158.69,45.47 161.8,45.47 165.8,41.47 165.8,32.45 165.1,31.75 159.64,31.75 158.94,32.45 158.94,37.27 150.3,45.91 150.3,69.47 150.69,69.85 157.73,69.85 157.73,64.26 156.27,62.8
  pour Bottom (isolate 0.305, rank 2): 158.75,73.6 159.45,72.9 159.45,46.48 158.43,45.47 149.61,45.47 148.84,46.23 148.84,72.01 150.43,73.6
  pour L3 (isolate 0.305, rank 2): 158.75,73.6 159.45,72.9 159.45,46.48 158.43,45.47 149.61,45.47 148.84,46.23 148.84,72.01 150.43,73.6
DIB_A0  (via drill 0.4)
  Top 0.254: R24.2 102.87,9.4 IC8.1 v98.37,9.4 v98.36,9.4
  Bottom 0.254: v98.36,9.4 78.55,9.4 77.98,8.83 75.97,8.83 X2.17
DIB_A1  (via drill 0.4)
  Top 0.254: R23.2 103.19,10.67 IC8.2 97.47,10.67 v97.41,10.73
  Bottom 0.254: X2.19 96.64,9.96 v97.41,10.73
DIB_A2  (via drill 0.4)
  Top 0.254: R22.2 102.87,13.02 101.85,12 100.61,12 IC8.3 v99.32,11.94 v99.31,11.94
  Bottom 0.254: X2.18 76.14,11.2 91.85,11.2 93.03,12.38 98.87,12.38 v99.31,11.94
DIB_CSA
  Top 0.254: IC3.4 116.84,5.97 115.44,4.57 RN1.2
DIB_CSB
  Top 0.254: IC3.5 118.11,6.48 115.3,3.67 RN1.1
DIB_IRQ  (via drill 0.4)
  Top 0.254: IC7.6 133.22,6.92 v130.94,4.64
  Bottom 0.254: v130.94,4.64 129.41,3.11 72.2,3.11 65.98,9.34 65.98,11.2 X2.10
DIB_MISO  (via drill 0.4)
  Top 0.254: IC3.6 v119.38,7.11
  L3 0.254: v119.38,7.11 75.82,7.11 73.6,9.34 73.6,10.54 72.9,11.24 71.02,11.24 X2.14
DIB_MOSI  (via drill 0.4)
  Top 0.254: IC7.3 129.41,6.79 128.08,5.46 v119.38,5.46 | RN1.3 v115.12,5.47 v115.13,5.46
  L3 0.254: v115.13,5.46 v119.38,5.46
DIB_SCL
  Top 0.203: IC8.6 95.76,11.94
  Top 0.254: IC8.6 94.55,11.94 94.11,12.38 91.89,12.38 87.12,7.62 61.94,7.62 X2.5
DIB_SCLK
  Top 0.254: IC3.3 115.57,7.18 114.76,6.37 RN1.4
DIB_SDA  (1 unrouted)
  Top 0.254: IC8.5 95.09,13.27 92.01,13.27 86.87,8.13 64.39,8.13 63.37,9.14 63.37,11.3 62.18,12.5
DP_S  (via drill 0.4)
  Top 0.305: 59.05,82.11 R26.1 | 66.74,84.45 66.8,84.39
  other vias: 59.12,81.03 59.88,81.03 60.64,81.03 58.36,81.03 61.72,82.55 61.72,83.31 61.72,81.79 57.28,82.55 57.28,83.31 57.28,81.79
  pour Top (isolate 0.305): 56.07,84.71 73.47,84.71 74.17,84.01 74.17,80.9 73.79,80.52 65.09,80.52 62.1,77.53 56.07,77.53
  pour Bottom (isolate 0.305): 44.83,84.33 64.2,84.33 64.2,77.53 44.83,77.53
  pour L3 (isolate 0.305): 44.83,84.33 64.2,84.33 64.2,77.53 44.83,77.53
FB
  Top 0.254: 157.23,82.17 C20.1 | IC1.5 157.86,81.54 C20.1 | C22.1 145.39,83.14 Q3.C 148.4,85.92 148.84,85.47 148.84,82.74 149.41,82.17 153.35,82.17 R11.1 R6.2 C20.1
GCOM  (via drill 0.4)
  Top 0.406: R42.1 69.59,25.97 v69.6,25.46
  Top 0.508: IC10.6 v89.09,28.26 89.98,28.26 90.36,27.88 IC10.7
  Top 0.61: v92.27,44.77 92.9,44.77 R58.1
  L3 0.61: v89.09,28.26 72.39,28.26 v69.6,25.46
  Bottom 0.61: v92.27,44.77 92.27,34.04 89.09,30.86 v89.09,28.26
GND  (via drill 0.4)
  Top 0.254: C58.1 v73.79,27.24 | C82.1 v114.43,27.43 | C80.1 v113.92,20.64 | v113.35,18.8 C81.1 | C75.1 v108.78,26.67 | C74.1 v108.78,22.73 | C77.1 v108.78,18.8 | C76.2 v108.78,30.61 | IC19.8 115.29,28.35 115.7,27.94 117.73,27.94 v117.92,27.75 | v24.96,71.75 R112.1 | IC13.4 122.1,61.61 v122.11,61.59 | 118.64,62.42 C64.1 118.59,61.62 v118.62,61.59 | C51.1 v63.88,19.18 | v114.3,12.57 IC3.15 | IC7.9 135.79,13.72 135.79,14.83 v135.7,14.92 | v121.92,12.57 121.96,13.78 IC3.9 | C79.1 v119.13,18.35 | C78.1 v121.03,18.8 | v92.52,20.32 92.01,19.94 IC17.8 | IC4.4 127.03,17.23 v127.13,17.46 | C49.1 v103.44,46.48 C53.1 | v103.12,48.58 C50.2 | IC14.10 131.8,50.71 v131.95,50.86 | C40.1 v143.7,32.26 | 152.91,4.51 R16.1 | 151.51,11.49 v151.64,11.37 | IC2.9 151.51,16.03 C32.1 C36.1 | v142.56,18.29 142.94,19.03 TR1.4 | v146.05,27.3 146.05,28.07 C24.2 | C30.2 143.32,26.42 v142.94,26.8 | IC6.5 v149.99,31.49 v149.99,31.5 | IC19.4 117.89,27.78 v117.92,27.75 | IC19.5 117.24,28.43 v117.92,27.75 | IC19.3 118.54,28.37 v117.92,27.75 | IC14.16 133.76,55.03 v133.79,54.99 | IC14.17 133.1,55.69 v133.79,54.99 | IC14.15 134.39,55.59 v133.79,54.99 | v17.72,73.41 Q23.E | R115.1 v30.99,56.96 | IC18.2 75.12,34.04 v74.99,33.91 | C48.2 v97.6,35.12 | R60.1 v102.42,55.75 | R66.1 v90.04,64.01 | D10.C v53.59,86.11 | v51.69,85.41 D9.C | Q11.2 83.63,83.31 v83.63,83.95 | 81.64,33.43 v81.6,33.47 81.6,34.33 C73.2 | C60.2 v102.17,34.61 | IC12.2 v107.12,31.94 | C44.2 78.32,30.89 v78.36,30.92 | Q10.2 82.87,31.81 v83.19,31.81 | v130.56,64.45 Q16.2 | v135.51,64.45 Q18.2 | Q25.2 v29.53,50.8 | Q21.2 v72.14,49.4 | v70.61,46.48 IC21.4 | v72.9,44.26 R83.1 | R92.2 v64.64,39.24
  Top 0.279: IC2.9 151.51,11.49
  Top 0.305: ZD3.1 v15.74,73.47 v15.75,73.47 | ZD3.2 13.85,73.41 v13.91,73.47 | v14.41,76.01 13.46,76.01 R79.1 | C52.1 v93.34,29.78 | C59.1 v86.11,29.72 C42.2 | v12.51,33.53 R73.2 | R38.2 v81.98,21.97 | 89.3,50.8 C56.1 | C72.1 v83.88,20.64 | R55.1 v88.96,83.38
  Top 0.406: v128.14,12.57 IC7.15 | C69.2 v88.84,24.64 | C71.1 v87,24.13 | IC15.4 v101.98,22.42 | C68.- 102.49,24.51 v102.36,24.13 | C66.2 106.43,21.21 v106.11,20.89 | C70.2 v96.14,19.37 | C34.1 v108.9,13.72 | D18.C v38.54,44.77 | C65.2 v131.51,44.51 | v122.87,18.67 123.74,18.67 C35.2 | 153.48,10.22 R19.1 155.96,10.22 156.4,9.78 156.4,5.21 155.89,4.7 155.32,4.7 C31.2 154.88,4.7 153.03,4.7 R16.1 | v149.86,26.8 149.86,26.03 C23.2 | v141.67,32.64 D7.C | C54.1 v89.35,49.84 v89.35,49.85 89.3,49.89 89.3,50.8 | C87.1 v116.59,44.58 | v111.38,55.88 110.53,55.88 C85.1 | C83.1 v64.14,43.62 | C39.1 123.67,12.85 v123.7,12.83 | C67.2 v144.02,62.42 | IC16.2 v147.96,66.61 | Q20.E 31.96,72.98 v31.94,72.96 | R104.1 v31.88,75.12 | v44.77,50.74 R98.1 R97.1 | v89.66,46.1 89.66,46.76 C57.2
  Top 0.61: D6.A v141.67,38.67
  Bottom 1.27: SH1.2 147.07,80.96
  other vias: 106.87,20.89 102.36,24.89 100.33,19.88 149.61,38.73 89.6,47.75 102.93,50.29 149.22,31.5 147.19,39.94 152.4,11.37 152.4,10.6 151.64,10.6 143.7,26.8 141.8,18.29 145.29,27.3 150.62,26.8 143.32,18.29 149.61,37.53 147.19,38.73 147.19,41.08 149.61,41.08 149.61,39.94 147.19,37.59 147.96,81.03 147.13,81.03 146.3,81.03 145.48,81.03 144.65,81.03
  pour Top (isolate 0.203): 94.81,23.81 107.31,23.81 107.31,17.97 94.81,17.97
  pour Bottom (isolate 0.254, rank 2): 13.97,84.52 21.78,84.52 32.26,95 148.08,95.06 148.08,45.85 152.91,41.02 152.91,28.57 157.16,24.32 157.16,1.91 156.4,1.14 138.37,1.14 137.67,1.84 137.67,11.3 136.78,12.19 108.78,12.19 105.73,15.24 57.15,15.24 56.2,16.19 56.2,35.62 57.09,36.51 60.33,36.51 61.21,37.4 61.21,41.91 60.33,42.8 27.24,42.8 26.54,43.5 14.8,43.5 13.21,45.09 13.21,60.2 12.95,60.45 7.18,60.45 6.86,60.77 6.86,63.18 7.18,63.5 12.95,63.5 13.21,63.75 13.21,83.76
  pour Top (isolate 0.254): 143.13,37.27 143.19,41.47 151.76,41.4 151.76,37.21
  pour Top (isolate 0.254, rank 2, no thermals): 139.45,12.89 154.81,12.89 154.81,9.4 146.88,9.4 146.49,9.02 146.49,2.86 139.95,2.86 138.87,3.94 138.87,12.32
  pour L2 (isolate 0.305, rank 3): -0.25,95.25 179.58,95.25 179.58,-0.25 137.67,-0.25 137.67,11.3 136.78,12.19 108.78,12.19 105.73,15.24 53.28,15.24 49.97,11.94 49.97,2.86 47.88,0.76 -0.25,0.76
GNDIO  (via drill 0.4)
  Top 0.254: IC7.2 v128.14,7.18 | v123.7,7.24 C38.2 | 92.75,11.37 C41.1 93.18,10.79 93.66,10.79 | IC8.7 95.15,10.7 95.25,10.79 93.66,10.79 | v93.66,11.24 93.66,10.79
  Top 0.406: IC3.2 v114.3,9.65
  other vias: 108.58,8.38 121.92,9.65 135.7,6.92 99.19,13.21 53.72,1.84 57.4,8.45 62.8,3.81 116.78,3.94 135.7,3.11 131.95,7.18
  pour Bottom (isolate 0.254): 53.85,13.72 53.09,12.95 53.09,1.78 53.66,1.21 135.45,1.21 136.02,1.78 136.02,9.91 135.25,10.67 108.2,10.67 105.16,13.72
  pour Top (isolate 0.254): 53.85,13.72 53.09,12.95 53.09,1.78 53.66,1.21 135.45,1.21 136.02,1.78 136.02,9.91 135.25,10.67 108.84,10.67 105.79,13.72
  pour L2 (isolate 0.254): 53.85,13.72 53.09,12.95 53.09,1.78 53.66,1.21 135.45,1.21 136.02,1.78 136.02,9.91 135.25,10.67 108.84,10.67 105.79,13.72
HO  (via drill 0.4)
  Top 0.254: IC1.18 158.86,75.78 v159.32,75.25
  Top 0.406: Q1.4
  Top 0.61: Q1.4 v158.93,69.14 v158.94,69.15
  L3 0.61: v159.32,75.25 158.93,74.86 v158.93,69.16 v158.94,69.15
HOLE_DL  (via drill 3.2 pad 5.5)
  other vias: 11,5.5
HOLE_UL  (via drill 3.2 pad 5.5)
  other vias: 11,89.5
I_MON  (via drill 0.4)
  Top 0.254: R81.1 109.79,32.7 | IC11.6 100.02,48.32 100.27,48.07 100.27,46.29 99.63,45.66 99.63,45.6 R65.2 v99.19,44.07 | R81.1 109.79,32.64 | 109.48,32.89 R81.1 | R62.1 v100.33,33.27 | R81.1 109.1,33.27 v104.01,33.27 104.03,33.26 IC12.4
  Bottom 0.254: v104.01,33.27 v100.33,33.27 99.19,34.42 v99.19,44.07
I_SERVO  (via drill 0.4)
  Top 0.254: 91.63,32.41 91.66,32.41 91.76,32.51 | R99.1 111.89,57.15 109.6,57.15 107.89,55.44 107.89,47.24 103.76,43.12 v93.98,43.12 88.17,43.12 D13.C | C55.2 v93.98,33.27 92.61,33.27 | 92.61,33.27 IC10.1 | C61.2 92.64,33.31 92.61,33.27
  Top 0.305: IC10.1 91.63,32.41
  Bottom 0.254: v93.98,43.12 v93.98,33.27
I_SET  (via drill 0.4)
  Top 0.254: R77.1 109.22,25.27 105.92,25.27 105.16,26.04 99.25,26.04 v98.68,25.46 96.01,25.46 90.3,19.75 90.3,18.99 89.27,17.96 IC17.4 | R57.1 98.3,36.96 98.68,36.58 v98.68,30.29
  L3 0.254: v98.68,30.29 v98.68,25.46
IRQ  (via drill 0.4)
  Top 0.254: IC14.20 131.14,53.99 v130.24,53.09 | v128.65,34.42 128.78,34.54 131.76,34.54 133.41,32.89 133.41,15.62 133.22,15.43 IC7.11
  Bottom 0.254: v128.65,34.42 128.71,34.48 128.71,47.5 130.24,49.02 v130.24,53.09
ISENSE+
  Top 0.254: R59.2 93.98,52.26 92.83,52.26 92.39,51.82 92.39,48.9 92.96,48.32 IC11.3 93.81,48.2 94.36,48.2 95.18,47.37 R58.2
ISENSE-
  Top 0.254: IC11.2 94.86,49.59 | 94.86,49.59 97.85,52.58 R68.2 | 94.86,49.59 95.12,49.33 95.44,49.01 97.28,47.17 R65.1
L_OUT  (via drill 0.4)
  Top 0.254: 172.47,70.55 172.28,70.74 | R8.1 142.94,83.19 R7.1 142.94,85.47 143.26,85.47 v144.84,87.06
  Top 1.27: R2.2 171.28,74.27 171.39,74.17
  L3 0.254: v144.84,87.06 156.91,87.06 162.24,81.72 162.24,80.52 167.13,75.63 167.13,75.56
  other vias: 171.51,68.58 171.51,67.75 171.51,66.93 171.51,66.1 171.51,65.28 171.51,64.45 171.51,63.63 171.51,62.8 171.51,61.98 171.51,61.15 171.51,60.33 172.09,74.17 172.09,73.34 172.09,72.52 172.09,71.75
  pour Top (isolate 0.305, no thermals): 166.24,75.25 165.86,74.87 165.86,71.12 167.13,69.85 168.97,69.85 169.48,69.34 169.48,58.04 173.67,53.85 176.72,53.85 176.78,53.91 176.78,67.63 173.23,71.18 173.23,74.1 172.09,75.25
  pour L3 (isolate 0.305, no thermals): 167.13,75.95 165.86,74.68 165.86,71.12 167.13,69.85 168.97,69.85 169.48,69.34 169.48,54.8 170.43,53.85 176.91,53.85 177.86,54.8 177.86,73.79 175.7,75.95
  pour Bottom (isolate 0.305, no thermals): 166.24,75.25 165.86,74.87 165.86,71.12 167.13,69.85 168.97,69.85 169.48,69.34 169.48,54.8 170.43,53.85 176.72,53.85 176.78,53.91 176.78,67.63 173.23,71.18 173.23,74.1 172.09,75.25
LO  (via drill 0.4)
  Top 0.254: v164.66,63.94 Q2.4 | IC1.13 156.36,75.97 156.15,75.75 156.15,74.68 v156.34,74.49
  L3 0.61: v164.66,63.94 158.37,63.94 157.92,64.39 157.92,73.03 156.46,74.49 v156.34,74.49
LOOP_CTRL  (via drill 0.4)
  Top 0.254: R93.2 109.85,44.07 109.85,43.69 108.52,42.35 87.12,42.35 86.3,43.18 86.3,46.7 | D11.A 85.41,47.62 v85.47,47.69
  Top 0.406: 87.22,46.67 D13.A 86.3,46.7 D11.A 83.72,46.7 R40.1 | R43.1 85.41,85.15 v85.47,85.03
  L3 0.406: v85.47,47.69 v85.47,85.03
MISO  (via drill 0.4)
  Top 0.254: IC19.15 119.19,22.67 119.44,22.42 121.28,22.42 122.11,21.59 v124.71,21.59 | v129.47,21.27 v129.48,21.27 | v129.48,21.27 129.54,21.27 130.75,22.48 v130.75,31.24 | 129.52,21.23 v129.48,21.27 | RN3.7 129.53,21.21 v129.48,21.27 | IC14.14 134.39,42.7 131.76,40.07 v131.25,40.07 | 134.43,49.3 IC14.14 | IC14.14 134.39,49.62 138.18,53.4 138.18,64.45 141.35,67.63 IC16.4
  L3 0.254: v124.71,21.59 129.16,21.59 v129.48,21.27
  Bottom 0.254: v131.25,40.07 131.25,39.62 131.57,39.31 131.57,33.21 130.75,32.38 v130.75,31.24
MOSI  (via drill 0.4)
  Top 0.254: IC17.7 93.42,19.25 v93.53,19.37 | IC19.16 119.84,23.94 120.59,23.94 v120.71,23.81 122.17,22.35 v123.95,22.35 | v131.32,41.27 132.21,41.27 133.76,42.82 IC14.13 | v130.42,20.63 v130.43,20.64 v130.44,20.63 RN3.6 | v129.48,22.35 129.98,22.86 129.98,30.92 v129.67,31.24
  L3 0.254: v120.71,23.81 120.4,23.5 120.4,21.78 115.51,16.89 95.69,16.89 93.53,19.05 v93.53,19.37 | v123.95,22.35 v129.48,22.35 130.49,21.34 130.49,20.7 v130.43,20.64
  Bottom 0.254: v131.32,41.27 130.49,40.45 130.49,39.62 131.06,39.05 131.06,33.47 129.67,32.07 v129.67,31.24
N$1
  Top 0.254: JP3.2 71.18,47.37 69.34,49.21 IC21.6
N$2
  Top 0.254: 81.64,29.23 R46.1 83.06,30.04 Q10.3
N$3
  Top 0.254: RN3.4 131.33,16.02 130.68,15.37 IC7.13
N$4
  Top 0.254: IC4.5 126.61,23.58 RN2.3
N$6
  Top 0.254: IC4.7 125.61,22.41 124.89,23.13 RN2.1 124.89,23.32
N$7
  Top 0.254: IC1.8 156.36,80.24 156.15,80.45 153.67,80.45 JP1.2
N$8  (via drill 0.4)
  Top 0.254: D1.C 145.83,56.93 v145.8,56.96 | IC1.1 159.88,78.86 v160.53,79.5 161.1,79.5 R3.2
  L3 0.254: v145.8,56.96 145.8,76.33 148.97,79.5 v160.53,79.5
N$9
  Top 0.254: IC3.11 119.38,14.48 120.59,15.68 128.33,15.68 129.53,16.89 RN3.2
N$10
  Top 0.254: C48.1 94.97,36.61 | 94.97,36.61 R57.2 | 94.97,36.61 92.81,36.61 R56.1
N$11
  Top 0.254: R67.2S 94.61,59.24
  Top 0.406: 94.61,59.24 94.68,59.24 94.81,59.12 95.06,58.86 95.34,58.59 R61.2
N$12
  Top 0.254: R73.1 12.51,30.35 11.56,29.4 9.54,29.4 LED1.CC
N$13  (via drill 0.4)
  Top 0.254: R101.2 35.37,68.46 v35.37,67.82 | R94.2 50.55,50.73 v50.93,50.35 | IC21.7 | IC21.7 68.08,49.6 67.75,49.28 58.48,49.28 v57.4,50.35 | IC21.7 68.08,51.95 68.2,52.07 71.56,52.07 72.2,51.44 Q21.1
  L3 0.254: v35.37,67.82 35.37,59.69 39.88,55.18 46.1,55.18 v50.93,50.35
  Bottom 0.254: v50.93,50.35 v57.4,50.35
N$14
  Top 0.254: C46.1 R51.2
N$15  (via drill 0.4)
  Top 0.254: RN1.7 v111.39,4.57 v111.38,4.57
  L3 0.254: X2.9 69.56,5.08 107.76,5.08 108.39,4.45 111.25,4.45 v111.38,4.57
N$16
  Top 0.254: Q3.E 147.59,87.48 146.94,88.14 143,88.14 | 143,88.14 141.51,88.14 D3.C | R7.2 142.94,88.08 143,88.14
N$17
  Top 0.406: R75.2 R76.1
N$18
  Top 0.406: 42.97,50.73 Q17.C
  Top 0.813: 42.97,50.73 R90.1 R89.1 | Q17.C 43.15,50.92 43.15,51.6 45.4,53.85 47.12,53.85 47.12,55.5 Q15.3
N$19
  Top 0.813: Q17.E 45.76,48.68 R98.2
N$20
  Top 0.254: D18.A 41.56,44.77 D17.C
N$21
  Top 0.254: Q17.B 42.17,47.69 | 42.17,47.69 42.17,46.76 D17.A | 42.17,47.69 42.23,47.63 46.93,47.63 47.88,48.58 R97.2 R94.1
N$22
  Top 0.254: IC4.6 126.11,22.8 125.79,23.11 RN2.2
N$23  (via drill 0.4)
  Top 0.254: RN1.5 112.48,6.35 111.38,6.35 v111.32,6.29
  L3 0.254: X2.13 73.62,6.1 109.09,6.1 109.67,5.52 110.3,5.52 111.06,6.29 v111.32,6.29
N$24
  Top 0.254: R103.2 ZD4.A
N$25
  cutout Bottom: 56.83,59.5 55.69,60.64 55.69,63.44 56.71,64.45 78.99,64.45 95.31,80.77 104.65,80.77 105.28,81.41 105.28,83.76 106.3,84.77 112.71,84.77 113.22,84.26 113.22,81.53 113.6,81.15 118.36,81.15 118.75,81.53 118.75,84.26 119.25,84.77 125.92,84.77 126.43,84.26 126.43,81.09 121.35,76.01 97.6,76.01 81.09,59.5
N$26
  Top 0.61: C28.2 145.35,13.04 R15.2
N$27  (via drill 0.4)
  Top 0.254: RN1.6 111,5.47 110.11,6.35 v109.98,6.35
  L3 0.254: X2.15 72.3,9.17 74.87,6.6 109.73,6.6 v109.98,6.35
N$28
  Top 0.254: Q20.B R104.2 R103.1
N$29
  Top 0.254: 141.23,35.36 141.23,34.49 TP3.1
  Top 0.61: FB3.P$1 139.91,36.68 141.23,35.36 D7.A 141.73,35.3 143.7,35.3 | IC6.1 143.7,35.3 | C40.2 143.7,35.3
N$30  (via drill 0.4)
  Top 0.254: v108.71,5.27 110.32,3.67 RN1.8
  L3 0.254: X2.12 68.52,11.2 68.52,9.4 72.33,5.59 108.39,5.59 v108.71,5.27
N$32
  Top 0.406: X3.1 9.35,64.64 R76.2
N$34
  Top 0.254: IC2.3 152.02,7.68 152.91,6.79 R16.2 151.26,4.51 151.01,4.51 R13.1
N$37
  Top 0.254: C55.1 R63.1
N$38
  Top 0.254: C19.1 155.32,84.07 R6.1
N$40
  Top 0.254: IC1.17 158.36,75.26 C8.1
N$41
  Top 0.254: IC2.4 152.53,7.94 153.16,7.3 154.11,7.3 155,6.41 C31.1
N$42  (via drill 0.4)
  Top 0.254: v123.13,65.98 123.13,62.8 124.47,61.45 Q14.3 | R74.2 54.86,86.74 54.86,77.6 61.59,70.87 62.36,70.87 63.56,69.66 120.78,69.66 121.79,68.64 v123.13,68.64
  L3 0.254: v123.13,65.98 v123.13,68.64
N$43
  Top 0.254: R9.2 161.67,81.79 161.04,81.79 160.78,81.53 160.78,80.9 159.64,79.75 IC1.2
N$44
  Top 0.254: Q19.4 R101.1 Q20.C
N$45
  Top 0.254: IC1.4 158.36,80.7 158.69,81.03 158.69,81.6 C20.2 C19.2
N$46
  Top 0.254: IC1.11 153.74,77.36 C12.1 153.35,77.15 R4.1
N$48
  Top 0.254: R19.2 153.04,8.32 153.03,8.32 153.03,8.85 IC2.5
N$50
  Top 0.254: IC2.8 152.02,14.22 153.41,15.62 C32.2 | 153.42,15.69 C32.2 | C32.2 153.48,16.26 153.35,16.38 | R20.2 C32.2
N$51
  Top 0.254: C36.2 155.45,18.16 R20.1
N$52  (via drill 0.4)
  Top 0.254: IC4.3 126.11,16.45 126.3,16.26 127.7,16.26 v127.95,16.51 | v127.57,19.49 127.57,23.64 RN2.4
  Bottom 0.254: v127.95,16.51 127.95,19.11 v127.57,19.49
N$53
  Top 0.254: IC1.3 158.86,80.31 159.19,80.64 159.77,80.64 160.27,81.15 160.27,83.06 161.42,84.2 C21.1
N$54  (via drill 0.4)
  Top 0.61: R34.2 v105.22,88.2
  L3 0.61: v105.22,88.2 120.71,88.2 125.28,83.63 Q5.1
N$56
  Top 0.254: IC13.6 121.14,65.36 120.52,65.98 117.47,65.98 116.27,64.77 R71.2 116.24,63.53 D15.A D16.A
N$57
  Top 0.254: IC12.1 105.91,30.98 R64.1
N$59
  Top 0.61: C11.2 154.46,70.67 R5.2
N$60
  Top 0.254: IC2.1 151.03,8.47 151,8.45 149.57,8.45 C27.2
N$61
  Top 0.254: RN3.3 130.44,16.32 129.41,15.3 IC7.14
N$62
  Top 0.254: IC2.7 152.53,13.97 152.84,14.29 154.87,14.29 R21.2 156.08,14.16 156.21,14.16 156.72,14.67 156.72,18.93 R18.1
N$70  (via drill 0.4)
  Top 0.254: 116.71,20.64 C80.2 116.52,20.66 116.52,21.65 117.24,22.37 IC19.12
  Top 0.305: C80.2 116.55,19.08 C81.2 | 121.67,27.18 R82.2
  Top 0.406: 116.27,18.48 C81.2 116.27,18.29 | v120.65,26.67 121.54,26.67 R82.2 | 116.71,20.64 116.97,20.64 v117.41,21.08
  L3 0.406: v120.65,26.67 119.76,26.67 117.41,24.32 v117.41,21.08
N$71
  Top 0.254: IC15.5 97.16,22.42 C70.1
N$72